# EAGLE schematic AM6548 (EAGLE 9.4.2), part 1 of 4

## Sheet 1 of 19: CPU General
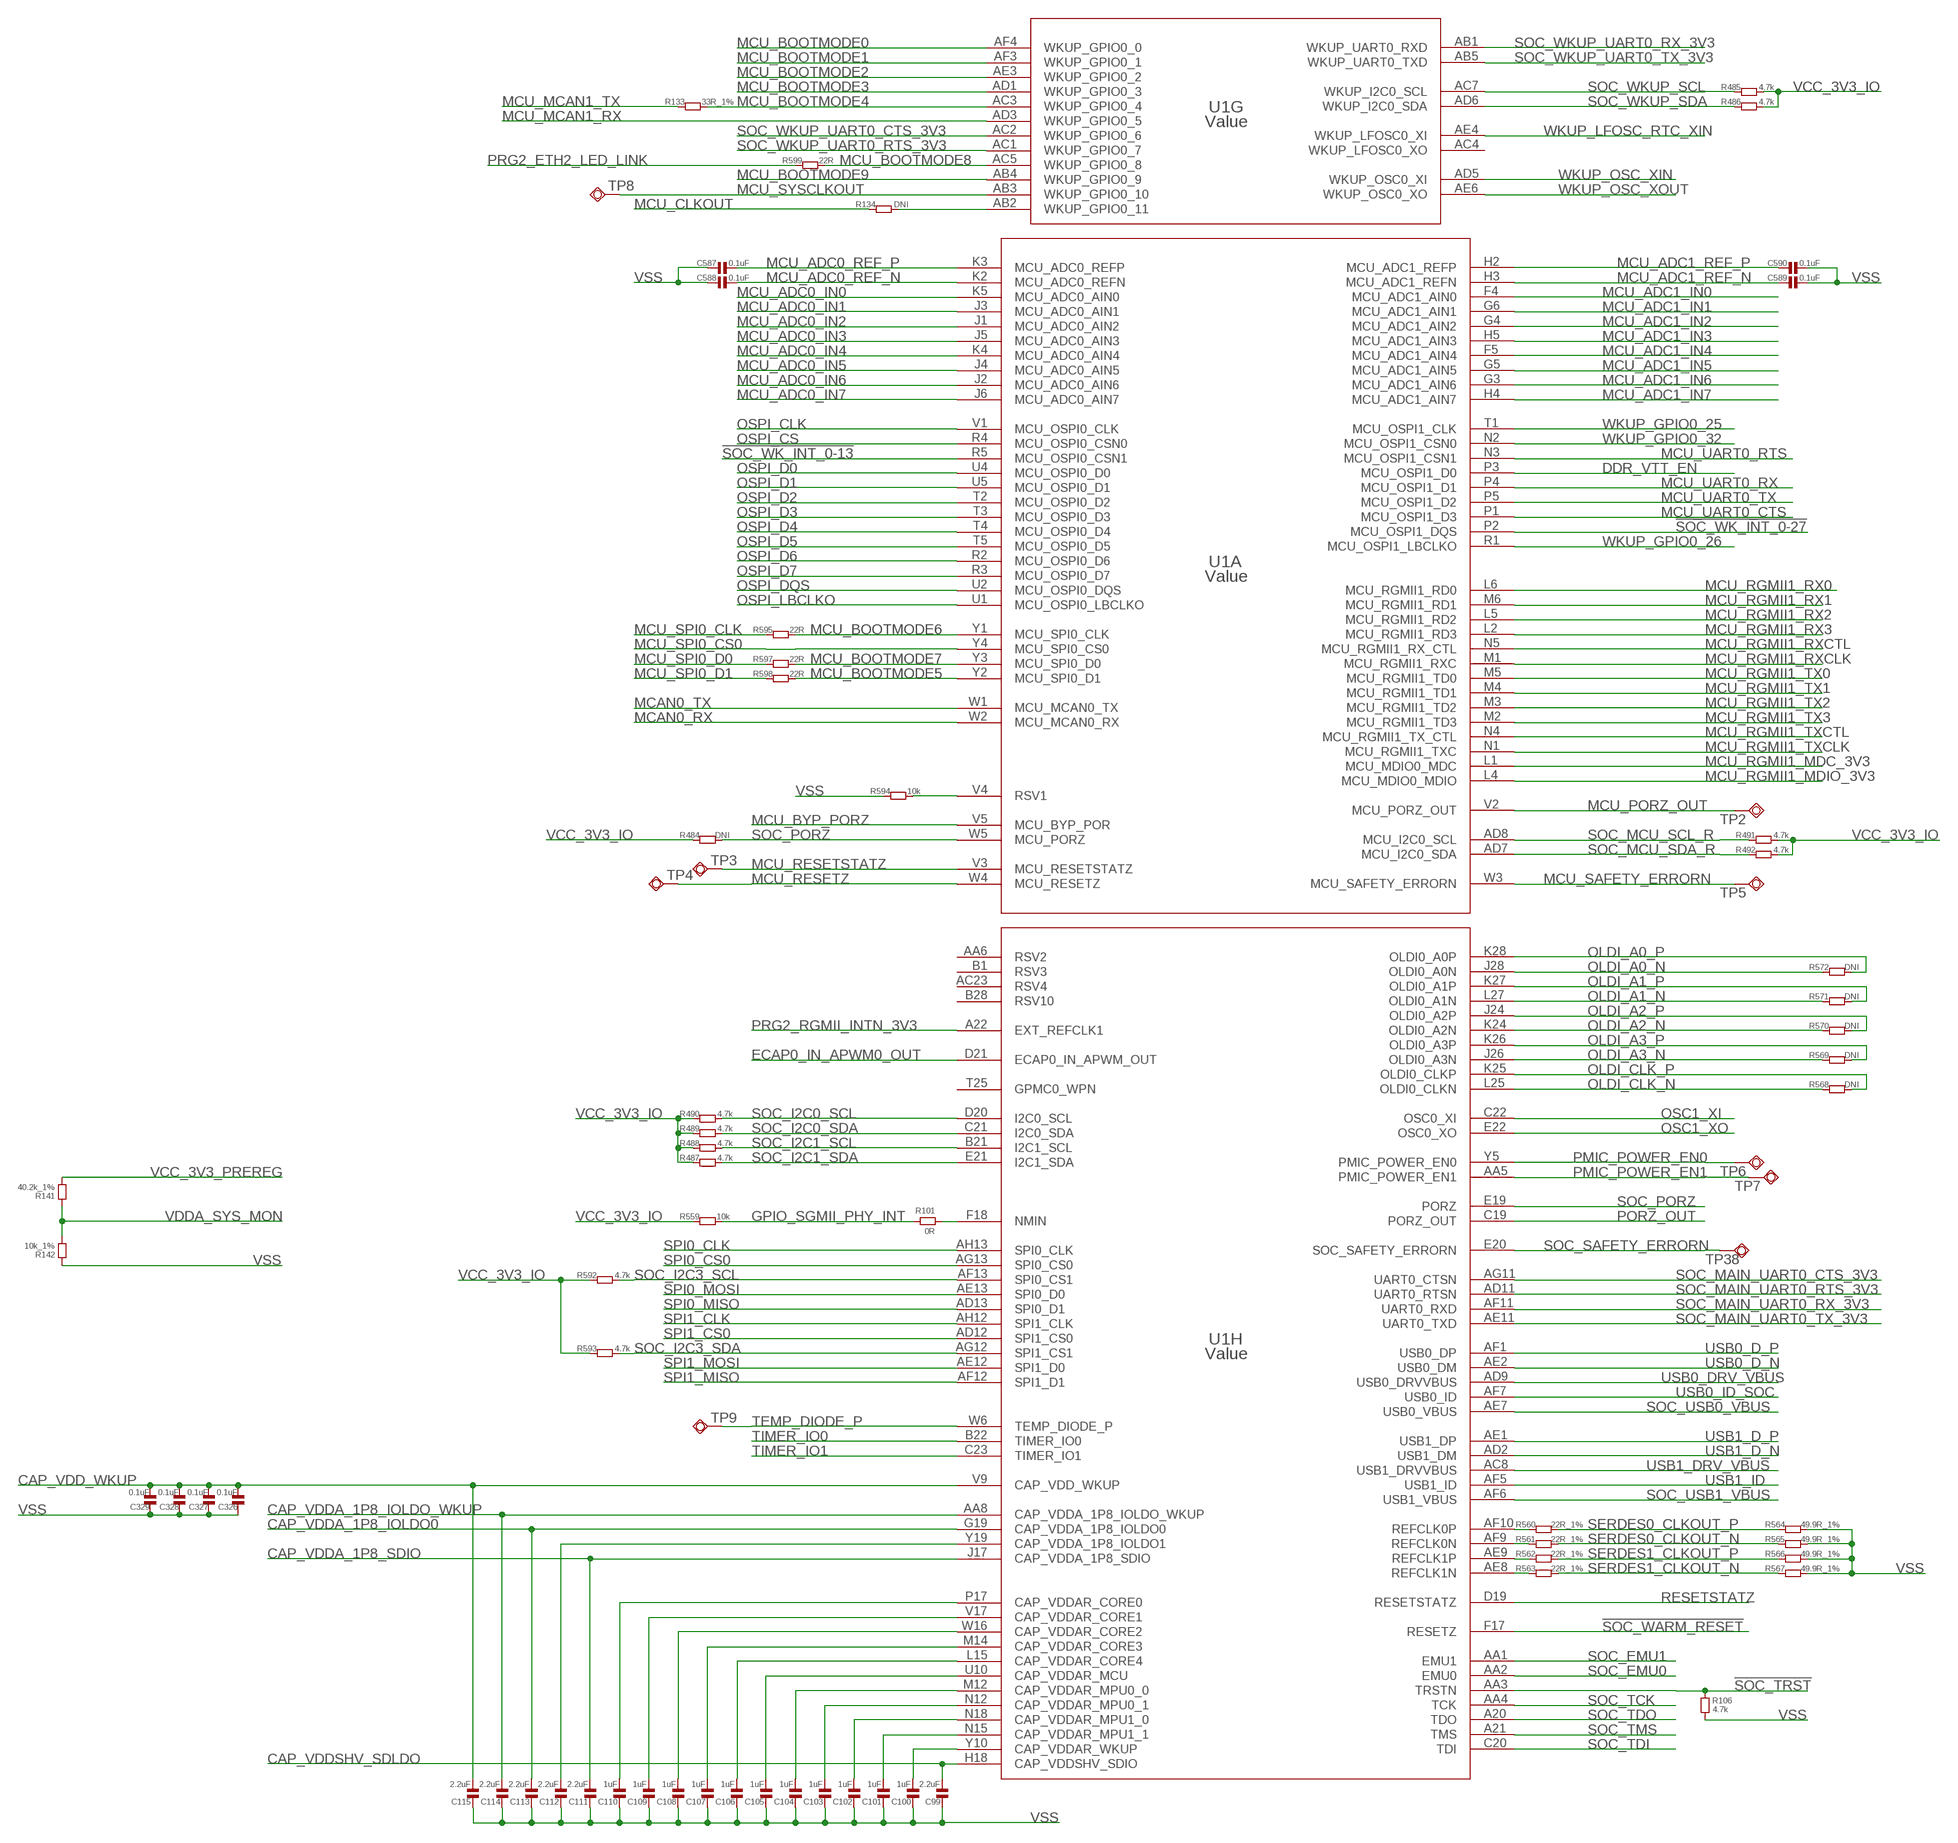
[diagram p0: schematic, sheet 1, part 1 of 2]
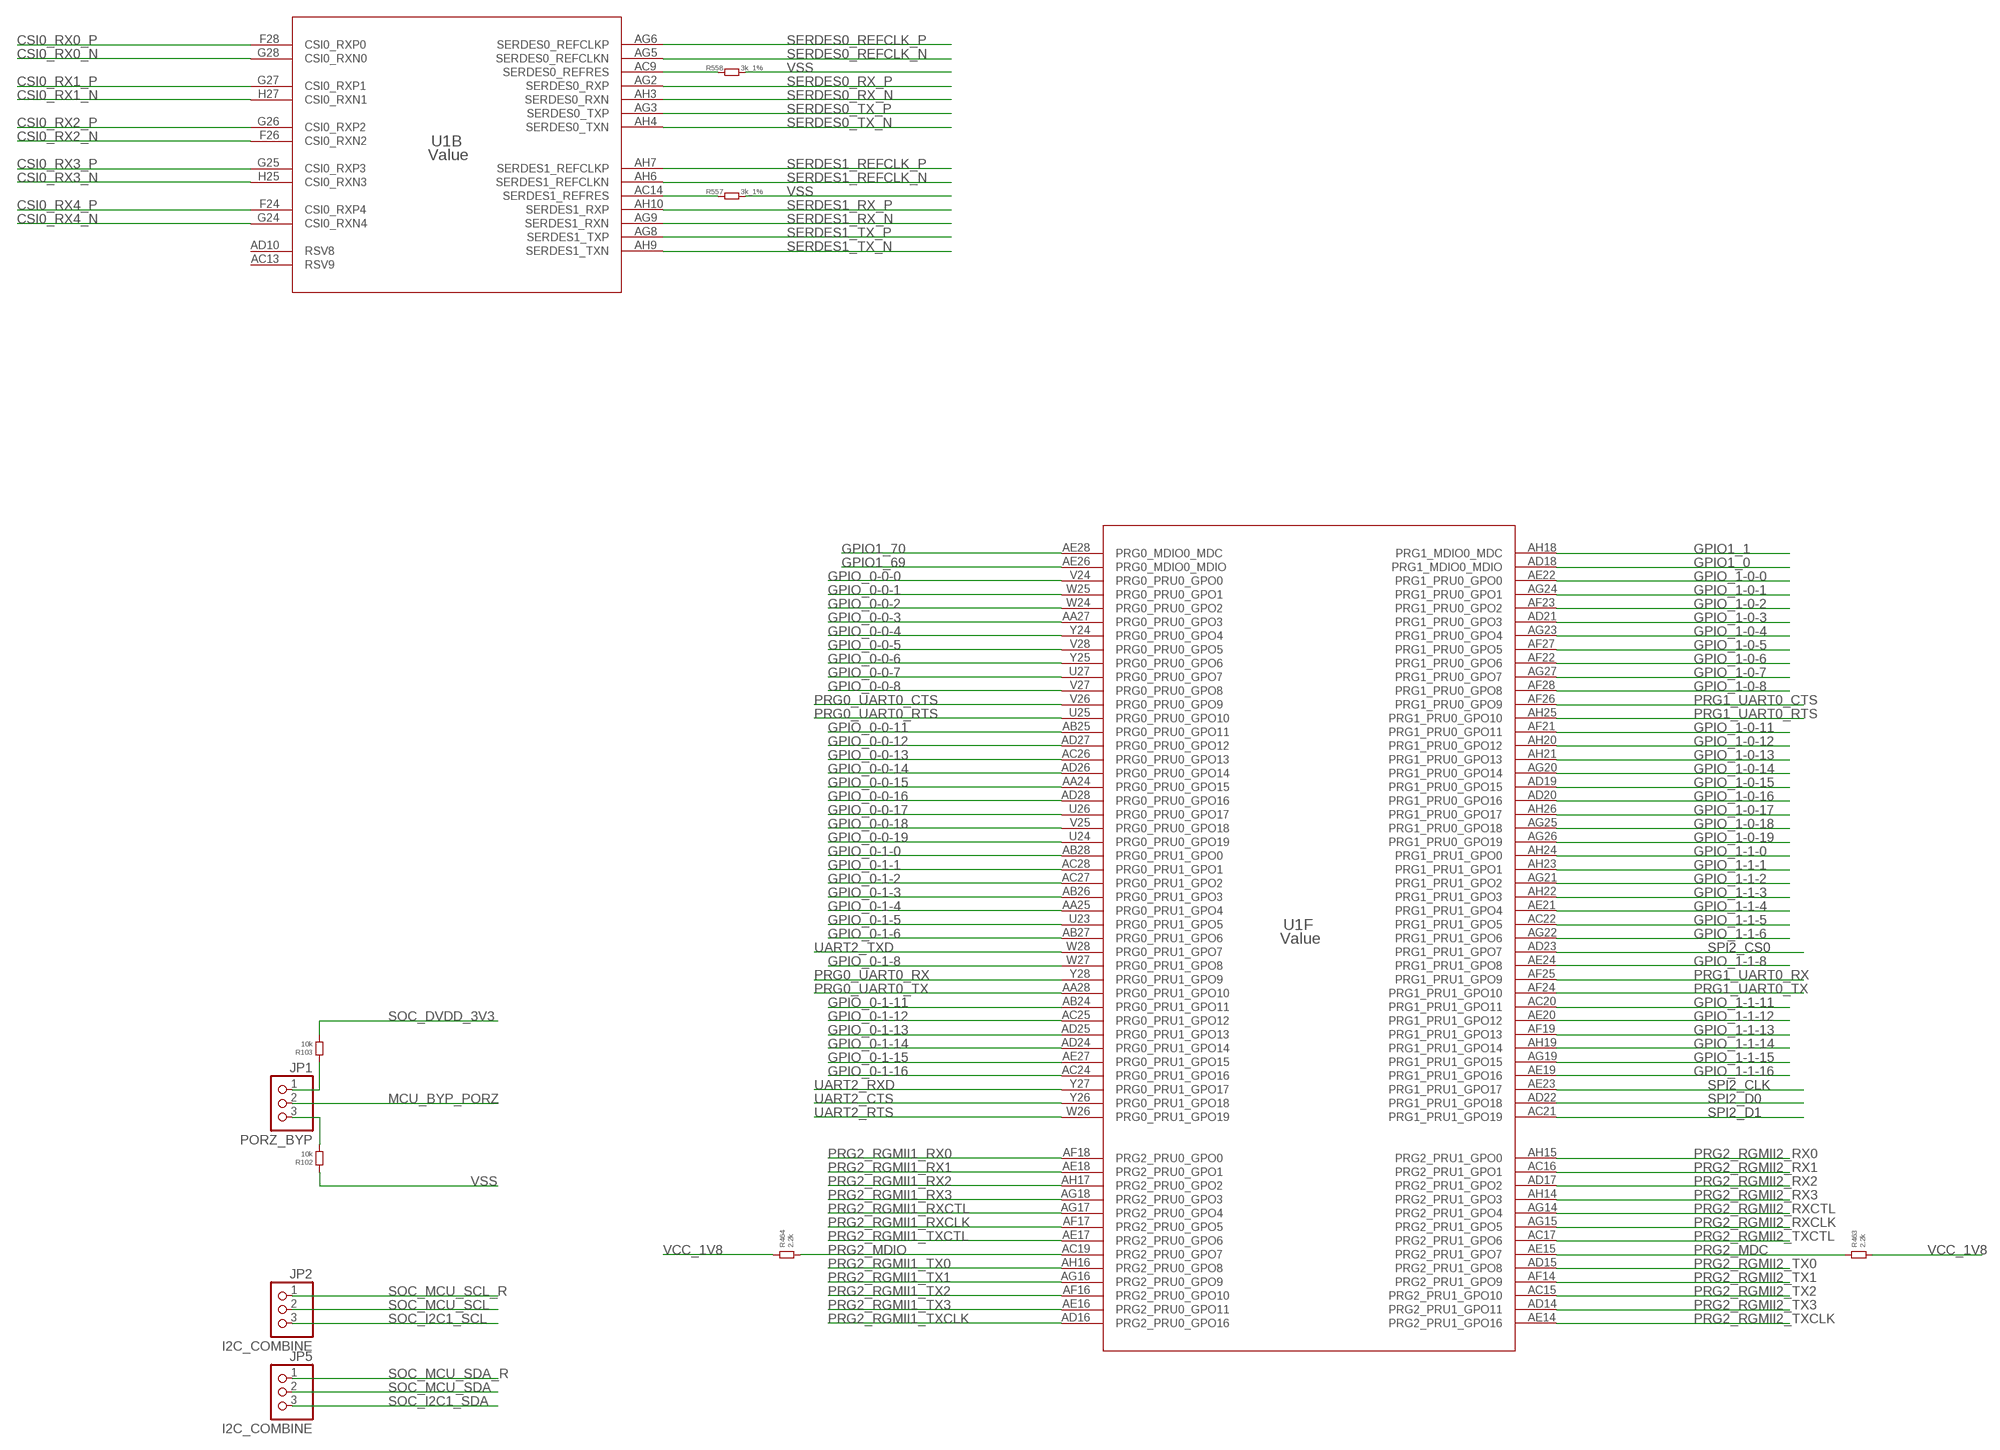
[diagram p1: schematic, sheet 1, part 2 of 2]

### Parts
C99  2.2uF  CAPACITOR.0201  [0201]
C100  1uF  CAPACITOR.0201  [0201]
C101  1uF  CAPACITOR.0201  [0201]
C102  1uF  CAPACITOR.0201  [0201]
C103  1uF  CAPACITOR.0201  [0201]
C104  1uF  CAPACITOR.0201  [0201]
C105  1uF  CAPACITOR.0201  [0201]
C106  1uF  CAPACITOR.0201  [0201]
C107  1uF  CAPACITOR.0201  [0201]
C108  1uF  CAPACITOR.0201  [0201]
C109  1uF  CAPACITOR.0201  [0201]
C110  1uF  CAPACITOR.0201  [0201]
C111  2.2uF  CAPACITOR.0201  [0201]
C112  2.2uF  CAPACITOR.0201  [0201]
C113  2.2uF  CAPACITOR.0201  [0201]
C114  2.2uF  CAPACITOR.0201  [0201]
C115  2.2uF  CAPACITOR.0201  [0201]
C326  0.1uF  CAPACITOR.0201  [0201]
C327  0.1uF  CAPACITOR.0201  [0201]
C328  0.1uF  CAPACITOR.0201  [0201]
C329  0.1uF  CAPACITOR.0201  [0201]
C587  0.1uF  CAPACITOR.0402  [0402]
C588  0.1uF  CAPACITOR.0402  [0402]
C589  0.1uF  CAPACITOR.0402  [0402]
C590  0.1uF  CAPACITOR.0402  [0402]
JP1  PORZ_BYP  PINHD-1X3  [1X03]
JP2  I2C_COMBINE  PINHD-1X3  [1X03]
JP5  I2C_COMBINE  PINHD-1X3  [1X03]
R101  0R  RESISTOR.0603  [0603]
R102  10k  RESISTOR.0603  [0603]
R103  10k  RESISTOR.0603  [0603]
R106  4.7k  RESISTOR.0402  [0402]
R133  33R_1%  RESISTOR.0402  [0402]
R134  DNI  RESISTOR.0402  [0402]
R141  40.2k_1%  RESISTOR.0603  [0603]
R142  10k_1%  RESISTOR.0603  [0603]
R463  2.2k  RESISTOR.0402  [0402]
R464  2.2k  RESISTOR.0402  [0402]
R484  DNI  RESISTOR.0603  [0603]
R485  4.7k  RESISTOR.0402  [0402]
R486  4.7k  RESISTOR.0402  [0402]
R487  4.7k  RESISTOR.0402  [0402]
R488  4.7k  RESISTOR.0402  [0402]
R489  4.7k  RESISTOR.0603  [0603]
R490  4.7k  RESISTOR.0603  [0603]
R491  4.7k  RESISTOR.0603  [0603]
R492  4.7k  RESISTOR.0603  [0603]
R557  3k_1%  RESISTOR.0402  [0402]
R558  3k_1%  RESISTOR.0402  [0402]
R559  10k  RESISTOR.0603  [0603]
R560  22R_1%  RESISTOR.0402  [0402]
R561  22R_1%  RESISTOR.0402  [0402]
R562  22R_1%  RESISTOR.0402  [0402]
R563  22R_1%  RESISTOR.0402  [0402]
R564  49.9R_1%  RESISTOR.0402  [0402]
R565  49.9R_1%  RESISTOR.0402  [0402]
R566  49.9R_1%  RESISTOR.0402  [0402]
R567  49.9R_1%  RESISTOR.0402  [0402]
R568  DNI  RESISTOR.0402  [0402]
R569  DNI  RESISTOR.0402  [0402]
R570  DNI  RESISTOR.0402  [0402]
R571  DNI  RESISTOR.0402  [0402]
R572  DNI  RESISTOR.0402  [0402]
R592  4.7k  RESISTOR.0603  [0603]
R593  4.7k  RESISTOR.0603  [0603]
R594  10k  RESISTOR.0603  [0603]
R595  22R  RESISTOR.0402  [0402]
R597  22R  RESISTOR.0402  [0402]
R598  22R  RESISTOR.0402  [0402]
R599  22R  RESISTOR.0603  [0603]
TP2  TESTPAD_TPSQB1,27  [TESTPAD_B1,27]
TP3  TESTPAD_TPSQB1,27  [TESTPAD_B1,27]
TP4  TESTPAD_TPSQB1,27  [TESTPAD_B1,27]
TP5  TESTPAD_TPSQB1,27  [TESTPAD_B1,27]
TP6  TESTPAD_TPSQB1,27  [TESTPAD_B1,27]
TP7  TESTPAD_TPSQB1,27  [TESTPAD_B1,27]
TP8  TESTPAD_TPSQB1,27  [TESTPAD_B1,27]
TP9  TESTPAD_TPSQB1,27  [TESTPAD_B1,27]
TP38  TESTPAD_TPSQB1,27  [TESTPAD_B1,27]
U1  Value  AM6548ACDXEAF  [ACD0784A]

### Nets
!SOC_TRST: R106.1 U1.AA3(H:TRSTN) ; also sheet 7
!SOC_WARM_RESET: U1.F17(H:RESETZ) ; also sheet 8
!SOC_WK_INT_0-13: U1.R5(A:MCU_OSPI0_CSN1) ; also sheet 8
!SOC_WK_INT_0-27: U1.P2(A:MCU_OSPI1_DQS) ; also sheet 8
CAP_VDD_WKUP: C115.2 C326.2 C327.2 C328.2 C329.2 U1.V9(H:CAP_VDD_WKUP) ; also sheet 2
CAP_VDDA_1P8_IOLDO0: C113.2 U1.G19(H:CAP_VDDA_1P8_IOLDO0) ; also sheet 2
CAP_VDDA_1P8_IOLDO_WKUP: C114.2 U1.AA8(H:CAP_VDDA_1P8_IOLDO_WKUP) ; also sheet 2
CAP_VDDA_1P8_SDIO: C111.2 U1.J17(H:CAP_VDDA_1P8_SDIO) ; also sheet 2
CAP_VDDSHV_SDLDO: C99.2 U1.H18(H:CAP_VDDSHV_SDIO) ; also sheet 2
CSI0_RX0_N: U1.G28(B:CSI0_RXN0) ; also sheet 19
CSI0_RX0_P: U1.F28(B:CSI0_RXP0) ; also sheet 19
CSI0_RX1_N: U1.H27(B:CSI0_RXN1) ; also sheet 19
CSI0_RX1_P: U1.G27(B:CSI0_RXP1) ; also sheet 19
CSI0_RX2_N: U1.F26(B:CSI0_RXN2) ; also sheet 19
CSI0_RX2_P: U1.G26(B:CSI0_RXP2) ; also sheet 19
CSI0_RX3_N: U1.H25(B:CSI0_RXN3) ; also sheet 19
CSI0_RX3_P: U1.G25(B:CSI0_RXP3) ; also sheet 19
CSI0_RX4_N: U1.G24(B:CSI0_RXN4) ; also sheet 19
CSI0_RX4_P: U1.F24(B:CSI0_RXP4) ; also sheet 19
DDR_VTT_EN: U1.P3(A:MCU_OSPI1_D0) ; also sheet 15
ECAP0_IN_APWM0_OUT: U1.D21(H:ECAP0_IN_APWM_OUT) ; also sheet 16
GPIO1_0: U1.AD18(F:PRG1_MDIO0_MDIO) ; also sheet 8,19
GPIO1_1: U1.AH18(F:PRG1_MDIO0_MDC) ; also sheet 8,19
GPIO1_69: U1.AE26(F:PRG0_MDIO0_MDIO) ; also sheet 19
GPIO1_70: U1.AE28(F:PRG0_MDIO0_MDC) ; also sheet 19
GPIO_0-0-0 [5mil]: U1.V24(F:PRG0_PRU0_GPO0) ; also sheet 19
GPIO_0-0-1 [5mil]: U1.W25(F:PRG0_PRU0_GPO1) ; also sheet 19
GPIO_0-0-2 [5mil]: U1.W24(F:PRG0_PRU0_GPO2) ; also sheet 19
GPIO_0-0-3 [5mil]: U1.AA27(F:PRG0_PRU0_GPO3) ; also sheet 19
GPIO_0-0-4 [5mil]: U1.Y24(F:PRG0_PRU0_GPO4) ; also sheet 19
GPIO_0-0-5 [5mil]: U1.V28(F:PRG0_PRU0_GPO5) ; also sheet 19
GPIO_0-0-6 [5mil]: U1.Y25(F:PRG0_PRU0_GPO6) ; also sheet 19
GPIO_0-0-7 [5mil]: U1.U27(F:PRG0_PRU0_GPO7) ; also sheet 19
GPIO_0-0-8 [5mil]: U1.V27(F:PRG0_PRU0_GPO8) ; also sheet 19
GPIO_0-0-11 [5mil]: U1.AB25(F:PRG0_PRU0_GPO11) ; also sheet 19
GPIO_0-0-12 [5mil]: U1.AD27(F:PRG0_PRU0_GPO12) ; also sheet 19
GPIO_0-0-13 [5mil]: U1.AC26(F:PRG0_PRU0_GPO13) ; also sheet 19
GPIO_0-0-14 [5mil]: U1.AD26(F:PRG0_PRU0_GPO14) ; also sheet 19
GPIO_0-0-15 [5mil]: U1.AA24(F:PRG0_PRU0_GPO15) ; also sheet 19
GPIO_0-0-16 [5mil]: U1.AD28(F:PRG0_PRU0_GPO16) ; also sheet 19
GPIO_0-0-17 [5mil]: U1.U26(F:PRG0_PRU0_GPO17) ; also sheet 19
GPIO_0-0-18 [5mil]: U1.V25(F:PRG0_PRU0_GPO18) ; also sheet 19
GPIO_0-0-19 [5mil]: U1.U24(F:PRG0_PRU0_GPO19) ; also sheet 19
GPIO_0-1-0 [5mil]: U1.AB28(F:PRG0_PRU1_GPO0) ; also sheet 19
GPIO_0-1-1 [5mil]: U1.AC28(F:PRG0_PRU1_GPO1) ; also sheet 19
GPIO_0-1-2 [5mil]: U1.AC27(F:PRG0_PRU1_GPO2) ; also sheet 19
GPIO_0-1-3 [5mil]: U1.AB26(F:PRG0_PRU1_GPO3) ; also sheet 19
GPIO_0-1-4 [5mil]: U1.AA25(F:PRG0_PRU1_GPO4) ; also sheet 19
GPIO_0-1-5 [5mil]: U1.U23(F:PRG0_PRU1_GPO5) ; also sheet 19
GPIO_0-1-6 [5mil]: U1.AB27(F:PRG0_PRU1_GPO6) ; also sheet 19
GPIO_0-1-8 [5mil]: U1.W27(F:PRG0_PRU1_GPO8) ; also sheet 19
GPIO_0-1-11 [5mil]: U1.AB24(F:PRG0_PRU1_GPO11) ; also sheet 19
GPIO_0-1-12 [5mil]: U1.AC25(F:PRG0_PRU1_GPO12) ; also sheet 19
GPIO_0-1-13 [5mil]: U1.AD25(F:PRG0_PRU1_GPO13) ; also sheet 19
GPIO_0-1-14 [5mil]: U1.AD24(F:PRG0_PRU1_GPO14) ; also sheet 19
GPIO_0-1-15 [5mil]: U1.AE27(F:PRG0_PRU1_GPO15) ; also sheet 19
GPIO_0-1-16 [5mil]: U1.AC24(F:PRG0_PRU1_GPO16) ; also sheet 19
GPIO_1-0-0 [5mil]: U1.AE22(F:PRG1_PRU0_GPO0) ; also sheet 19
GPIO_1-0-1 [5mil]: U1.AG24(F:PRG1_PRU0_GPO1) ; also sheet 19
GPIO_1-0-2 [5mil]: U1.AF23(F:PRG1_PRU0_GPO2) ; also sheet 19
GPIO_1-0-3 [5mil]: U1.AD21(F:PRG1_PRU0_GPO3) ; also sheet 19
GPIO_1-0-4 [5mil]: U1.AG23(F:PRG1_PRU0_GPO4) ; also sheet 19
GPIO_1-0-5 [5mil]: U1.AF27(F:PRG1_PRU0_GPO5) ; also sheet 19
GPIO_1-0-6 [5mil]: U1.AF22(F:PRG1_PRU0_GPO6) ; also sheet 19
GPIO_1-0-7 [5mil]: U1.AG27(F:PRG1_PRU0_GPO7) ; also sheet 19
GPIO_1-0-8 [5mil]: U1.AF28(F:PRG1_PRU0_GPO8) ; also sheet 19
GPIO_1-0-11 [5mil]: U1.AF21(F:PRG1_PRU0_GPO11) ; also sheet 19
GPIO_1-0-12 [5mil]: U1.AH20(F:PRG1_PRU0_GPO12) ; also sheet 19
GPIO_1-0-13 [5mil]: U1.AH21(F:PRG1_PRU0_GPO13) ; also sheet 19
GPIO_1-0-14 [5mil]: U1.AG20(F:PRG1_PRU0_GPO14) ; also sheet 19
GPIO_1-0-15 [5mil]: U1.AD19(F:PRG1_PRU0_GPO15) ; also sheet 19
GPIO_1-0-16 [5mil]: U1.AD20(F:PRG1_PRU0_GPO16) ; also sheet 19
GPIO_1-0-17 [5mil]: U1.AH26(F:PRG1_PRU0_GPO17) ; also sheet 19
GPIO_1-0-18 [5mil]: U1.AG25(F:PRG1_PRU0_GPO18) ; also sheet 19
GPIO_1-0-19 [5mil]: U1.AG26(F:PRG1_PRU0_GPO19) ; also sheet 19
GPIO_1-1-0 [5mil]: U1.AH24(F:PRG1_PRU1_GPO0) ; also sheet 19
GPIO_1-1-1 [5mil]: U1.AH23(F:PRG1_PRU1_GPO1) ; also sheet 19
GPIO_1-1-2 [5mil]: U1.AG21(F:PRG1_PRU1_GPO2) ; also sheet 19
GPIO_1-1-3 [5mil]: U1.AH22(F:PRG1_PRU1_GPO3) ; also sheet 19
GPIO_1-1-4 [5mil]: U1.AE21(F:PRG1_PRU1_GPO4) ; also sheet 19
GPIO_1-1-5 [5mil]: U1.AC22(F:PRG1_PRU1_GPO5) ; also sheet 19
GPIO_1-1-6 [5mil]: U1.AG22(F:PRG1_PRU1_GPO6) ; also sheet 19
GPIO_1-1-8 [5mil]: U1.AE24(F:PRG1_PRU1_GPO8) ; also sheet 19
GPIO_1-1-11 [5mil]: U1.AC20(F:PRG1_PRU1_GPO11) ; also sheet 19
GPIO_1-1-12 [5mil]: U1.AE20(F:PRG1_PRU1_GPO12) ; also sheet 19
GPIO_1-1-13 [5mil]: U1.AF19(F:PRG1_PRU1_GPO13) ; also sheet 19
GPIO_1-1-14 [5mil]: U1.AH19(F:PRG1_PRU1_GPO14) ; also sheet 19
GPIO_1-1-15 [5mil]: U1.AG19(F:PRG1_PRU1_GPO15) ; also sheet 19
GPIO_1-1-16 [5mil]: U1.AE19(F:PRG1_PRU1_GPO16) ; also sheet 19
GPIO_SGMII_PHY_INT: R101.1 R559.2 ; also sheet 19
MCAN0_RX: U1.W2(A:MCU_MCAN0_RX) ; also sheet 19
MCAN0_TX: U1.W1(A:MCU_MCAN0_TX) ; also sheet 19
MCU_ADC0_IN0: U1.K5(A:MCU_ADC0_AIN0) ; also sheet 19
MCU_ADC0_IN1: U1.J3(A:MCU_ADC0_AIN1) ; also sheet 19
MCU_ADC0_IN2: U1.J1(A:MCU_ADC0_AIN2) ; also sheet 19
MCU_ADC0_IN3: U1.J5(A:MCU_ADC0_AIN3) ; also sheet 19
MCU_ADC0_IN4: U1.K4(A:MCU_ADC0_AIN4) ; also sheet 19
MCU_ADC0_IN5: U1.J4(A:MCU_ADC0_AIN5) ; also sheet 19
MCU_ADC0_IN6: U1.J2(A:MCU_ADC0_AIN6) ; also sheet 19
MCU_ADC0_IN7: U1.J6(A:MCU_ADC0_AIN7) ; also sheet 19
MCU_ADC0_REF_N: C588.2 U1.K2(A:MCU_ADC0_REFN) ; also sheet 19
MCU_ADC0_REF_P: C587.2 U1.K3(A:MCU_ADC0_REFP) ; also sheet 19
MCU_ADC1_IN0: U1.F4(A:MCU_ADC1_AIN0)
MCU_ADC1_IN1: U1.G6(A:MCU_ADC1_AIN1)
MCU_ADC1_IN2: U1.G4(A:MCU_ADC1_AIN2)
MCU_ADC1_IN3: U1.H5(A:MCU_ADC1_AIN3)
MCU_ADC1_IN4: U1.F5(A:MCU_ADC1_AIN4)
MCU_ADC1_IN5: U1.G5(A:MCU_ADC1_AIN5)
MCU_ADC1_IN6: U1.G3(A:MCU_ADC1_AIN6)
MCU_ADC1_IN7: U1.H4(A:MCU_ADC1_AIN7)
MCU_ADC1_REF_N: C589.1 U1.H3(A:MCU_ADC1_REFN)
MCU_ADC1_REF_P: C590.1 U1.H2(A:MCU_ADC1_REFP)
MCU_BOOTMODE0: U1.AF4(G:WKUP_GPIO0_0) ; also sheet 6,11
MCU_BOOTMODE1: U1.AF3(G:WKUP_GPIO0_1) ; also sheet 6,11
MCU_BOOTMODE2: U1.AE3(G:WKUP_GPIO0_2) ; also sheet 11
MCU_BOOTMODE3: U1.AD1(G:WKUP_GPIO0_3) ; also sheet 11
MCU_BOOTMODE4: R133.2 U1.AC3(G:WKUP_GPIO0_4) ; also sheet 11
MCU_BOOTMODE5: R598.2 U1.Y2(A:MCU_SPI0_D1) ; also sheet 11
MCU_BOOTMODE6: R595.2 U1.Y1(A:MCU_SPI0_CLK) ; also sheet 11
MCU_BOOTMODE7: R597.2 U1.Y3(A:MCU_SPI0_D0) ; also sheet 11
MCU_BOOTMODE8: R599.2 U1.AC5(G:WKUP_GPIO0_8) ; also sheet 11
MCU_BOOTMODE9: U1.AB4(G:WKUP_GPIO0_9) ; also sheet 11
MCU_BYP_PORZ: JP1.2 U1.V5(A:MCU_BYP_POR)
MCU_CLKOUT: R134.1 ; also sheet 14
MCU_MCAN1_RX: U1.AD3(G:WKUP_GPIO0_5) ; also sheet 19
MCU_MCAN1_TX: R133.1 ; also sheet 19
MCU_PORZ_OUT: TP2.TP U1.V2(A:MCU_PORZ_OUT)
MCU_RESETSTATZ: TP3.TP U1.V3(A:MCU_RESETSTATZ)
MCU_RESETZ: TP4.TP U1.W4(A:MCU_RESETZ)
MCU_RGMII1_MDC_3V3: U1.L1(A:MCU_MDIO0_MDC) ; also sheet 6
MCU_RGMII1_MDIO_3V3: U1.L4(A:MCU_MDIO0_MDIO) ; also sheet 6
MCU_RGMII1_RX0: U1.L6(A:MCU_RGMII1_RD0) ; also sheet 6
MCU_RGMII1_RX1: U1.M6(A:MCU_RGMII1_RD1) ; also sheet 6
MCU_RGMII1_RX2: U1.L5(A:MCU_RGMII1_RD2) ; also sheet 6
MCU_RGMII1_RX3: U1.L2(A:MCU_RGMII1_RD3) ; also sheet 6
MCU_RGMII1_RXCLK: U1.M1(A:MCU_RGMII1_RXC) ; also sheet 6
MCU_RGMII1_RXCTL: U1.N5(A:MCU_RGMII1_RX_CTL) ; also sheet 6
MCU_RGMII1_TX0: U1.M5(A:MCU_RGMII1_TD0) ; also sheet 6
MCU_RGMII1_TX1: U1.M4(A:MCU_RGMII1_TD1) ; also sheet 6
MCU_RGMII1_TX2: U1.M3(A:MCU_RGMII1_TD2) ; also sheet 6
MCU_RGMII1_TX3: U1.M2(A:MCU_RGMII1_TD3) ; also sheet 6
MCU_RGMII1_TXCLK: U1.N1(A:MCU_RGMII1_TXC) ; also sheet 6
MCU_RGMII1_TXCTL: U1.N4(A:MCU_RGMII1_TX_CTL) ; also sheet 6
MCU_SAFETY_ERRORN: TP5.TP U1.W3(A:MCU_SAFETY_ERRORN)
MCU_SPI0_CLK: R595.1 ; also sheet 19
MCU_SPI0_CS0: U1.Y4(A:MCU_SPI0_CS0)
MCU_SPI0_D0: R597.1 ; also sheet 19
MCU_SPI0_D1: R598.1 ; also sheet 19
MCU_SYSCLKOUT: TP8.TP U1.AB3(G:WKUP_GPIO0_10)
MCU_UART0_CTS: U1.P1(A:MCU_OSPI1_D3) ; also sheet 19
MCU_UART0_RTS: U1.N3(A:MCU_OSPI1_CSN1) ; also sheet 19
MCU_UART0_RX: U1.P4(A:MCU_OSPI1_D1) ; also sheet 19
MCU_UART0_TX: U1.P5(A:MCU_OSPI1_D2) ; also sheet 19
N$81: R134.2 U1.AB2(G:WKUP_GPIO0_11)
N$103: R101.2 U1.F18(H:NMIN)
N$104: JP1.1 R103.1
N$105: JP1.3 R102.2
N$124: C100.2 U1.Y10(H:CAP_VDDAR_WKUP)
N$125: C101.2 U1.N15(H:CAP_VDDAR_MPU1_1)
N$126: C102.2 U1.N18(H:CAP_VDDAR_MPU1_0)
N$127: C103.2 U1.N12(H:CAP_VDDAR_MPU0_1)
N$128: C104.2 U1.M12(H:CAP_VDDAR_MPU0_0)
N$129: C105.2 U1.U10(H:CAP_VDDAR_MCU)
N$130: C106.2 U1.L15(H:CAP_VDDAR_CORE4)
N$131: C107.2 U1.M14(H:CAP_VDDAR_CORE3)
N$132: C108.2 U1.W16(H:CAP_VDDAR_CORE2)
N$133: C109.2 U1.V17(H:CAP_VDDAR_CORE1)
N$134: C110.2 U1.P17(H:CAP_VDDAR_CORE0)
N$136: C112.2 U1.Y19(H:CAP_VDDA_1P8_IOLDO1)
N$194: R594.2 U1.V4(A:RSV1)
N$397: R560.1 U1.AF10(H:REFCLK0P)
N$398: R561.1 U1.AF9(H:REFCLK0N)
N$399: R562.1 U1.AE9(H:REFCLK1P)
N$400: R563.1 U1.AE8(H:REFCLK1N)
N$409: R557.1 U1.AC14(B:SERDES1_REFRES)
N$410: R558.1 U1.AC9(B:SERDES0_REFRES)
OLDI_A0_N: R572.1 U1.J28(H:OLDI0_A0N) ; also sheet 16
OLDI_A0_P: R572.2 U1.K28(H:OLDI0_A0P) ; also sheet 16
OLDI_A1_N: R571.1 U1.L27(H:OLDI0_A1N) ; also sheet 16
OLDI_A1_P: R571.2 U1.K27(H:OLDI0_A1P) ; also sheet 16
OLDI_A2_N: R570.1 U1.K24(H:OLDI0_A2N) ; also sheet 16
OLDI_A2_P: R570.2 U1.J24(H:OLDI0_A2P) ; also sheet 16
OLDI_A3_N: R569.1 U1.J26(H:OLDI0_A3N) ; also sheet 16
OLDI_A3_P: R569.2 U1.K26(H:OLDI0_A3P) ; also sheet 16
OLDI_CLK_N: R568.1 U1.L25(H:OLDI0_CLKN) ; also sheet 16
OLDI_CLK_P: R568.2 U1.K25(H:OLDI0_CLKP) ; also sheet 16
OSC1_XI: U1.C22(H:OSC0_XI) ; also sheet 14
OSC1_XO: U1.E22(H:OSC0_XO) ; also sheet 14
OSPI_CLK: U1.V1(A:MCU_OSPI0_CLK) ; also sheet 18
OSPI_CS: U1.R4(A:MCU_OSPI0_CSN0) ; also sheet 18
OSPI_D0: U1.U4(A:MCU_OSPI0_D0) ; also sheet 18
OSPI_D1: U1.U5(A:MCU_OSPI0_D1) ; also sheet 18
OSPI_D2: U1.T2(A:MCU_OSPI0_D2) ; also sheet 18
OSPI_D3: U1.T3(A:MCU_OSPI0_D3) ; also sheet 18
OSPI_D4: U1.T4(A:MCU_OSPI0_D4) ; also sheet 18
OSPI_D5: U1.T5(A:MCU_OSPI0_D5) ; also sheet 18
OSPI_D6: U1.R2(A:MCU_OSPI0_D6) ; also sheet 18
OSPI_D7: U1.R3(A:MCU_OSPI0_D7) ; also sheet 18
OSPI_DQS: U1.U2(A:MCU_OSPI0_DQS) ; also sheet 18
OSPI_LBCLKO: U1.U1(A:MCU_OSPI0_LBCLKO)
PMIC_POWER_EN0: TP6.TP U1.Y5(H:PMIC_POWER_EN0)
PMIC_POWER_EN1: TP7.TP U1.AA5(H:PMIC_POWER_EN1)
PORZ_OUT: U1.C19(H:PORZ_OUT) ; also sheet 6,11,13,16,17,18,19
PRG0_UART0_CTS: U1.V26(F:PRG0_PRU0_GPO9) ; also sheet 19
PRG0_UART0_RTS: U1.U25(F:PRG0_PRU0_GPO10) ; also sheet 19
PRG0_UART0_RX: U1.Y28(F:PRG0_PRU1_GPO9) ; also sheet 19
PRG0_UART0_TX: U1.AA28(F:PRG0_PRU1_GPO10) ; also sheet 19
PRG1_UART0_CTS: U1.AF26(F:PRG1_PRU0_GPO9) ; also sheet 19
PRG1_UART0_RTS: U1.AH25(F:PRG1_PRU0_GPO10) ; also sheet 19
PRG1_UART0_RX: U1.AF25(F:PRG1_PRU1_GPO9) ; also sheet 19
PRG1_UART0_TX: U1.AF24(F:PRG1_PRU1_GPO10) ; also sheet 19
PRG2_ETH2_LED_LINK: R599.1
PRG2_MDC: R463.1 U1.AE15(F:PRG2_PRU1_GPO7) ; also sheet 6
PRG2_MDIO: R464.2 U1.AC19(F:PRG2_PRU0_GPO7) ; also sheet 6
PRG2_RGMII1_RX0: U1.AF18(F:PRG2_PRU0_GPO0) ; also sheet 6
PRG2_RGMII1_RX1: U1.AE18(F:PRG2_PRU0_GPO1) ; also sheet 6
PRG2_RGMII1_RX2: U1.AH17(F:PRG2_PRU0_GPO2) ; also sheet 6
PRG2_RGMII1_RX3: U1.AG18(F:PRG2_PRU0_GPO3) ; also sheet 6
PRG2_RGMII1_RXCLK: U1.AF17(F:PRG2_PRU0_GPO5) ; also sheet 6
PRG2_RGMII1_RXCTL: U1.AG17(F:PRG2_PRU0_GPO4) ; also sheet 6
PRG2_RGMII1_TX0: U1.AH16(F:PRG2_PRU0_GPO8) ; also sheet 6
PRG2_RGMII1_TX1: U1.AG16(F:PRG2_PRU0_GPO9) ; also sheet 6
PRG2_RGMII1_TX2: U1.AF16(F:PRG2_PRU0_GPO10) ; also sheet 6
PRG2_RGMII1_TX3: U1.AE16(F:PRG2_PRU0_GPO11) ; also sheet 6
PRG2_RGMII1_TXCLK: U1.AD16(F:PRG2_PRU0_GPO16) ; also sheet 6
PRG2_RGMII1_TXCTL: U1.AE17(F:PRG2_PRU0_GPO6) ; also sheet 6
PRG2_RGMII2_RX0: U1.AH15(F:PRG2_PRU1_GPO0) ; also sheet 6
PRG2_RGMII2_RX1: U1.AC16(F:PRG2_PRU1_GPO1) ; also sheet 6
PRG2_RGMII2_RX2: U1.AD17(F:PRG2_PRU1_GPO2) ; also sheet 6
PRG2_RGMII2_RX3: U1.AH14(F:PRG2_PRU1_GPO3) ; also sheet 6
PRG2_RGMII2_RXCLK: U1.AG15(F:PRG2_PRU1_GPO5) ; also sheet 6
PRG2_RGMII2_RXCTL: U1.AG14(F:PRG2_PRU1_GPO4) ; also sheet 6
PRG2_RGMII2_TX0: U1.AD15(F:PRG2_PRU1_GPO8) ; also sheet 6
PRG2_RGMII2_TX1: U1.AF14(F:PRG2_PRU1_GPO9) ; also sheet 6
PRG2_RGMII2_TX2: U1.AC15(F:PRG2_PRU1_GPO10) ; also sheet 6
PRG2_RGMII2_TX3: U1.AD14(F:PRG2_PRU1_GPO11) ; also sheet 6
PRG2_RGMII2_TXCLK: U1.AE14(F:PRG2_PRU1_GPO16) ; also sheet 6
PRG2_RGMII2_TXCTL: U1.AC17(F:PRG2_PRU1_GPO6) ; also sheet 6
PRG2_RGMII_INTN_3V3: U1.A22(H:EXT_REFCLK1)
RESETSTATZ: U1.D19(H:RESETSTATZ)
SERDES0_CLKOUT_N: R561.2 R565.1 ; also sheet 19
SERDES0_CLKOUT_P: R560.2 R564.1 ; also sheet 19
SERDES0_REFCLK_N: U1.AG5(B:SERDES0_REFCLKN) ; also sheet 19
SERDES0_REFCLK_P: U1.AG6(B:SERDES0_REFCLKP) ; also sheet 19
SERDES0_RX_N: U1.AH3(B:SERDES0_RXN) ; also sheet 19
SERDES0_RX_P: U1.AG2(B:SERDES0_RXP) ; also sheet 19
SERDES0_TX_N: U1.AH4(B:SERDES0_TXN) ; also sheet 19
SERDES0_TX_P: U1.AG3(B:SERDES0_TXP) ; also sheet 19
SERDES1_CLKOUT_N: R563.2 R567.1 ; also sheet 19
SERDES1_CLKOUT_P: R562.2 R566.1 ; also sheet 19
SERDES1_REFCLK_N: U1.AH6(B:SERDES1_REFCLKN) ; also sheet 19
SERDES1_REFCLK_P: U1.AH7(B:SERDES1_REFCLKP) ; also sheet 19
SERDES1_RX_N: U1.AG9(B:SERDES1_RXN) ; also sheet 19
SERDES1_RX_P: U1.AH10(B:SERDES1_RXP) ; also sheet 19
SERDES1_TX_N: U1.AH9(B:SERDES1_TXN) ; also sheet 19
SERDES1_TX_P: U1.AG8(B:SERDES1_TXP) ; also sheet 19
SOC_DVDD_3V3: R103.2 ; also sheet 2,10
SOC_EMU0: U1.AA2(H:EMU0) ; also sheet 7
SOC_EMU1: U1.AA1(H:EMU1) ; also sheet 7
SOC_I2C0_SCL: R490.2 U1.D20(H:I2C0_SCL) ; also sheet 14,19
SOC_I2C0_SDA: R489.2 U1.C21(H:I2C0_SDA) ; also sheet 14,19
SOC_I2C1_SCL: JP2.3 R488.2 U1.B21(H:I2C1_SCL) ; also sheet 16,19
SOC_I2C1_SDA: JP5.3 R487.2 U1.E21(H:I2C1_SDA) ; also sheet 16,19
SOC_I2C3_SCL: R592.2 U1.AF13(H:SPI0_CS1) ; also sheet 19
SOC_I2C3_SDA: R593.2 U1.AG12(H:SPI1_CS1) ; also sheet 19
SOC_MAIN_UART0_CTS_3V3: U1.AG11(H:UART0_CTSN)
SOC_MAIN_UART0_RTS_3V3: U1.AD11(H:UART0_RTSN)
SOC_MAIN_UART0_RX_3V3: U1.AF11(H:UART0_RXD)
SOC_MAIN_UART0_TX_3V3: U1.AE11(H:UART0_TXD)
SOC_MCU_SCL: JP2.2 ; also sheet 15,19
SOC_MCU_SCL_R: JP2.1 R491.1 U1.AD8(A:MCU_I2C0_SCL)
SOC_MCU_SDA: JP5.2 ; also sheet 15,19
SOC_MCU_SDA_R: JP5.1 R492.1 U1.AD7(A:MCU_I2C0_SDA)
SOC_PORZ: R484.2 U1.E19(H:PORZ) U1.W5(A:MCU_PORZ) ; also sheet 5
SOC_SAFETY_ERRORN: TP38.TP U1.E20(H:SOC_SAFETY_ERRORN)
SOC_TCK: U1.AA4(H:TCK) ; also sheet 7
SOC_TDI: U1.C20(H:TDI) ; also sheet 7
SOC_TDO: U1.A20(H:TDO) ; also sheet 7
SOC_TMS: U1.A21(H:TMS) ; also sheet 7
SOC_USB0_VBUS: U1.AE7(H:USB0_VBUS) ; also sheet 9
SOC_USB1_VBUS [6mil]: U1.AF6(H:USB1_VBUS) ; also sheet 9
SOC_WKUP_SCL: R485.1 U1.AC7(G:WKUP_I2C0_SCL) ; also sheet 3,15,16,17,19
SOC_WKUP_SDA: R486.1 U1.AD6(G:WKUP_I2C0_SDA) ; also sheet 3,15,16,17,19
SOC_WKUP_UART0_CTS_3V3: U1.AC2(G:WKUP_GPIO0_6)
SOC_WKUP_UART0_RTS_3V3: U1.AC1(G:WKUP_GPIO0_7)
SOC_WKUP_UART0_RX_3V3: U1.AB1(G:WKUP_UART0_RXD)
SOC_WKUP_UART0_TX_3V3: U1.AB5(G:WKUP_UART0_TXD)
SPI0_CLK: U1.AH13(H:SPI0_CLK) ; also sheet 19
SPI0_CS0: U1.AG13(H:SPI0_CS0) ; also sheet 19
SPI0_MISO: U1.AD13(H:SPI0_D1) ; also sheet 19
SPI0_MOSI: U1.AE13(H:SPI0_D0) ; also sheet 19
SPI1_CLK: U1.AH12(H:SPI1_CLK) ; also sheet 16,19
SPI1_CS0: U1.AD12(H:SPI1_CS0) ; also sheet 16,19
SPI1_MISO: U1.AF12(H:SPI1_D1) ; also sheet 16,19
SPI1_MOSI: U1.AE12(H:SPI1_D0) ; also sheet 16,19
SPI2_CLK: U1.AE23(F:PRG1_PRU1_GPO17)
SPI2_CS0: U1.AD23(F:PRG1_PRU1_GPO7)
SPI2_D0: U1.AD22(F:PRG1_PRU1_GPO18)
SPI2_D1: U1.AC21(F:PRG1_PRU1_GPO19)
TEMP_DIODE_P: TP9.TP U1.W6(H:TEMP_DIODE_P)
TIMER_IO0: U1.B22(H:TIMER_IO0)
TIMER_IO1: U1.C23(H:TIMER_IO1)
UART2_CTS: U1.Y26(F:PRG0_PRU1_GPO18) ; also sheet 19
UART2_RTS: U1.W26(F:PRG0_PRU1_GPO19) ; also sheet 19
UART2_RXD: U1.Y27(F:PRG0_PRU1_GPO17) ; also sheet 19
UART2_TXD: U1.W28(F:PRG0_PRU1_GPO7) ; also sheet 19
USB0_D_N [6mil]: U1.AE2(H:USB0_DM) ; also sheet 19
USB0_D_P [6mil]: U1.AF1(H:USB0_DP) ; also sheet 19
USB0_DRV_VBUS [6mil]: U1.AD9(H:USB0_DRVVBUS) ; also sheet 19
USB0_ID_SOC [6mil]: U1.AF7(H:USB0_ID) ; also sheet 19
USB1_D_N [6mil]: U1.AD2(H:USB1_DM) ; also sheet 9
USB1_D_P [6mil]: U1.AE1(H:USB1_DP) ; also sheet 9
USB1_DRV_VBUS [6mil]: U1.AC8(H:USB1_DRVVBUS)
USB1_ID [6mil]: U1.AF5(H:USB1_ID) ; also sheet 9
VCC_1V8: R463.2 R464.1 ; also sheet 3,6,7,8,10,13,14,15,18,19
VCC_3V3_IO: R484.1 R485.2 R486.2 R487.1 R488.1 R489.1 R490.1 R491.2 R492.2 R559.1 R592.1 R593.1 ; also sheet 3,5,6,7,8,9,10,11,13,14,15,16,17,19
VCC_3V3_PREREG: R141.2 ; also sheet 3,5
VDDA_SYS_MON: R141.1 R142.2 ; also sheet 2
VSS: C99.1 C100.1 C101.1 C102.1 C103.1 C104.1 C105.1 C106.1 C107.1 C108.1 C109.1 C110.1 C111.1 C112.1 C113.1 C114.1 C115.1 C326.1 C327.1 C328.1 C329.1 C587.1 C588.1 C589.2 C590.2 R102.1 R106.2 R142.1 R557.2 R558.2 R564.2 R565.2 R566.2 R567.2 R594.1 ; also sheet 2,3,4,5,6,7,8,9,10,11,12,13,14,15,16,17,18,19
WKUP_GPIO0_25: U1.T1(A:MCU_OSPI1_CLK)
WKUP_GPIO0_26: U1.R1(A:MCU_OSPI1_LBCLKO)
WKUP_GPIO0_32: U1.N2(A:MCU_OSPI1_CSN0)
WKUP_LFOSC_RTC_XIN: U1.AE4(G:WKUP_LFOSC0_XI) ; also sheet 14
WKUP_OSC_XIN: U1.AD5(G:WKUP_OSC0_XI) ; also sheet 14
WKUP_OSC_XOUT: U1.AE6(G:WKUP_OSC0_XO) ; also sheet 14
Unconnected: U1.AA6(H:RSV2) U1.AC4(G:WKUP_LFOSC0_XO) U1.AC13(B:RSV9) U1.AC23(H:RSV4) U1.AD10(B:RSV8) U1.B1(H:RSV3) U1.B28(H:RSV10) U1.T25(H:GPMC0_WPN)

## Sheet 2 of 19: Power & Decaps
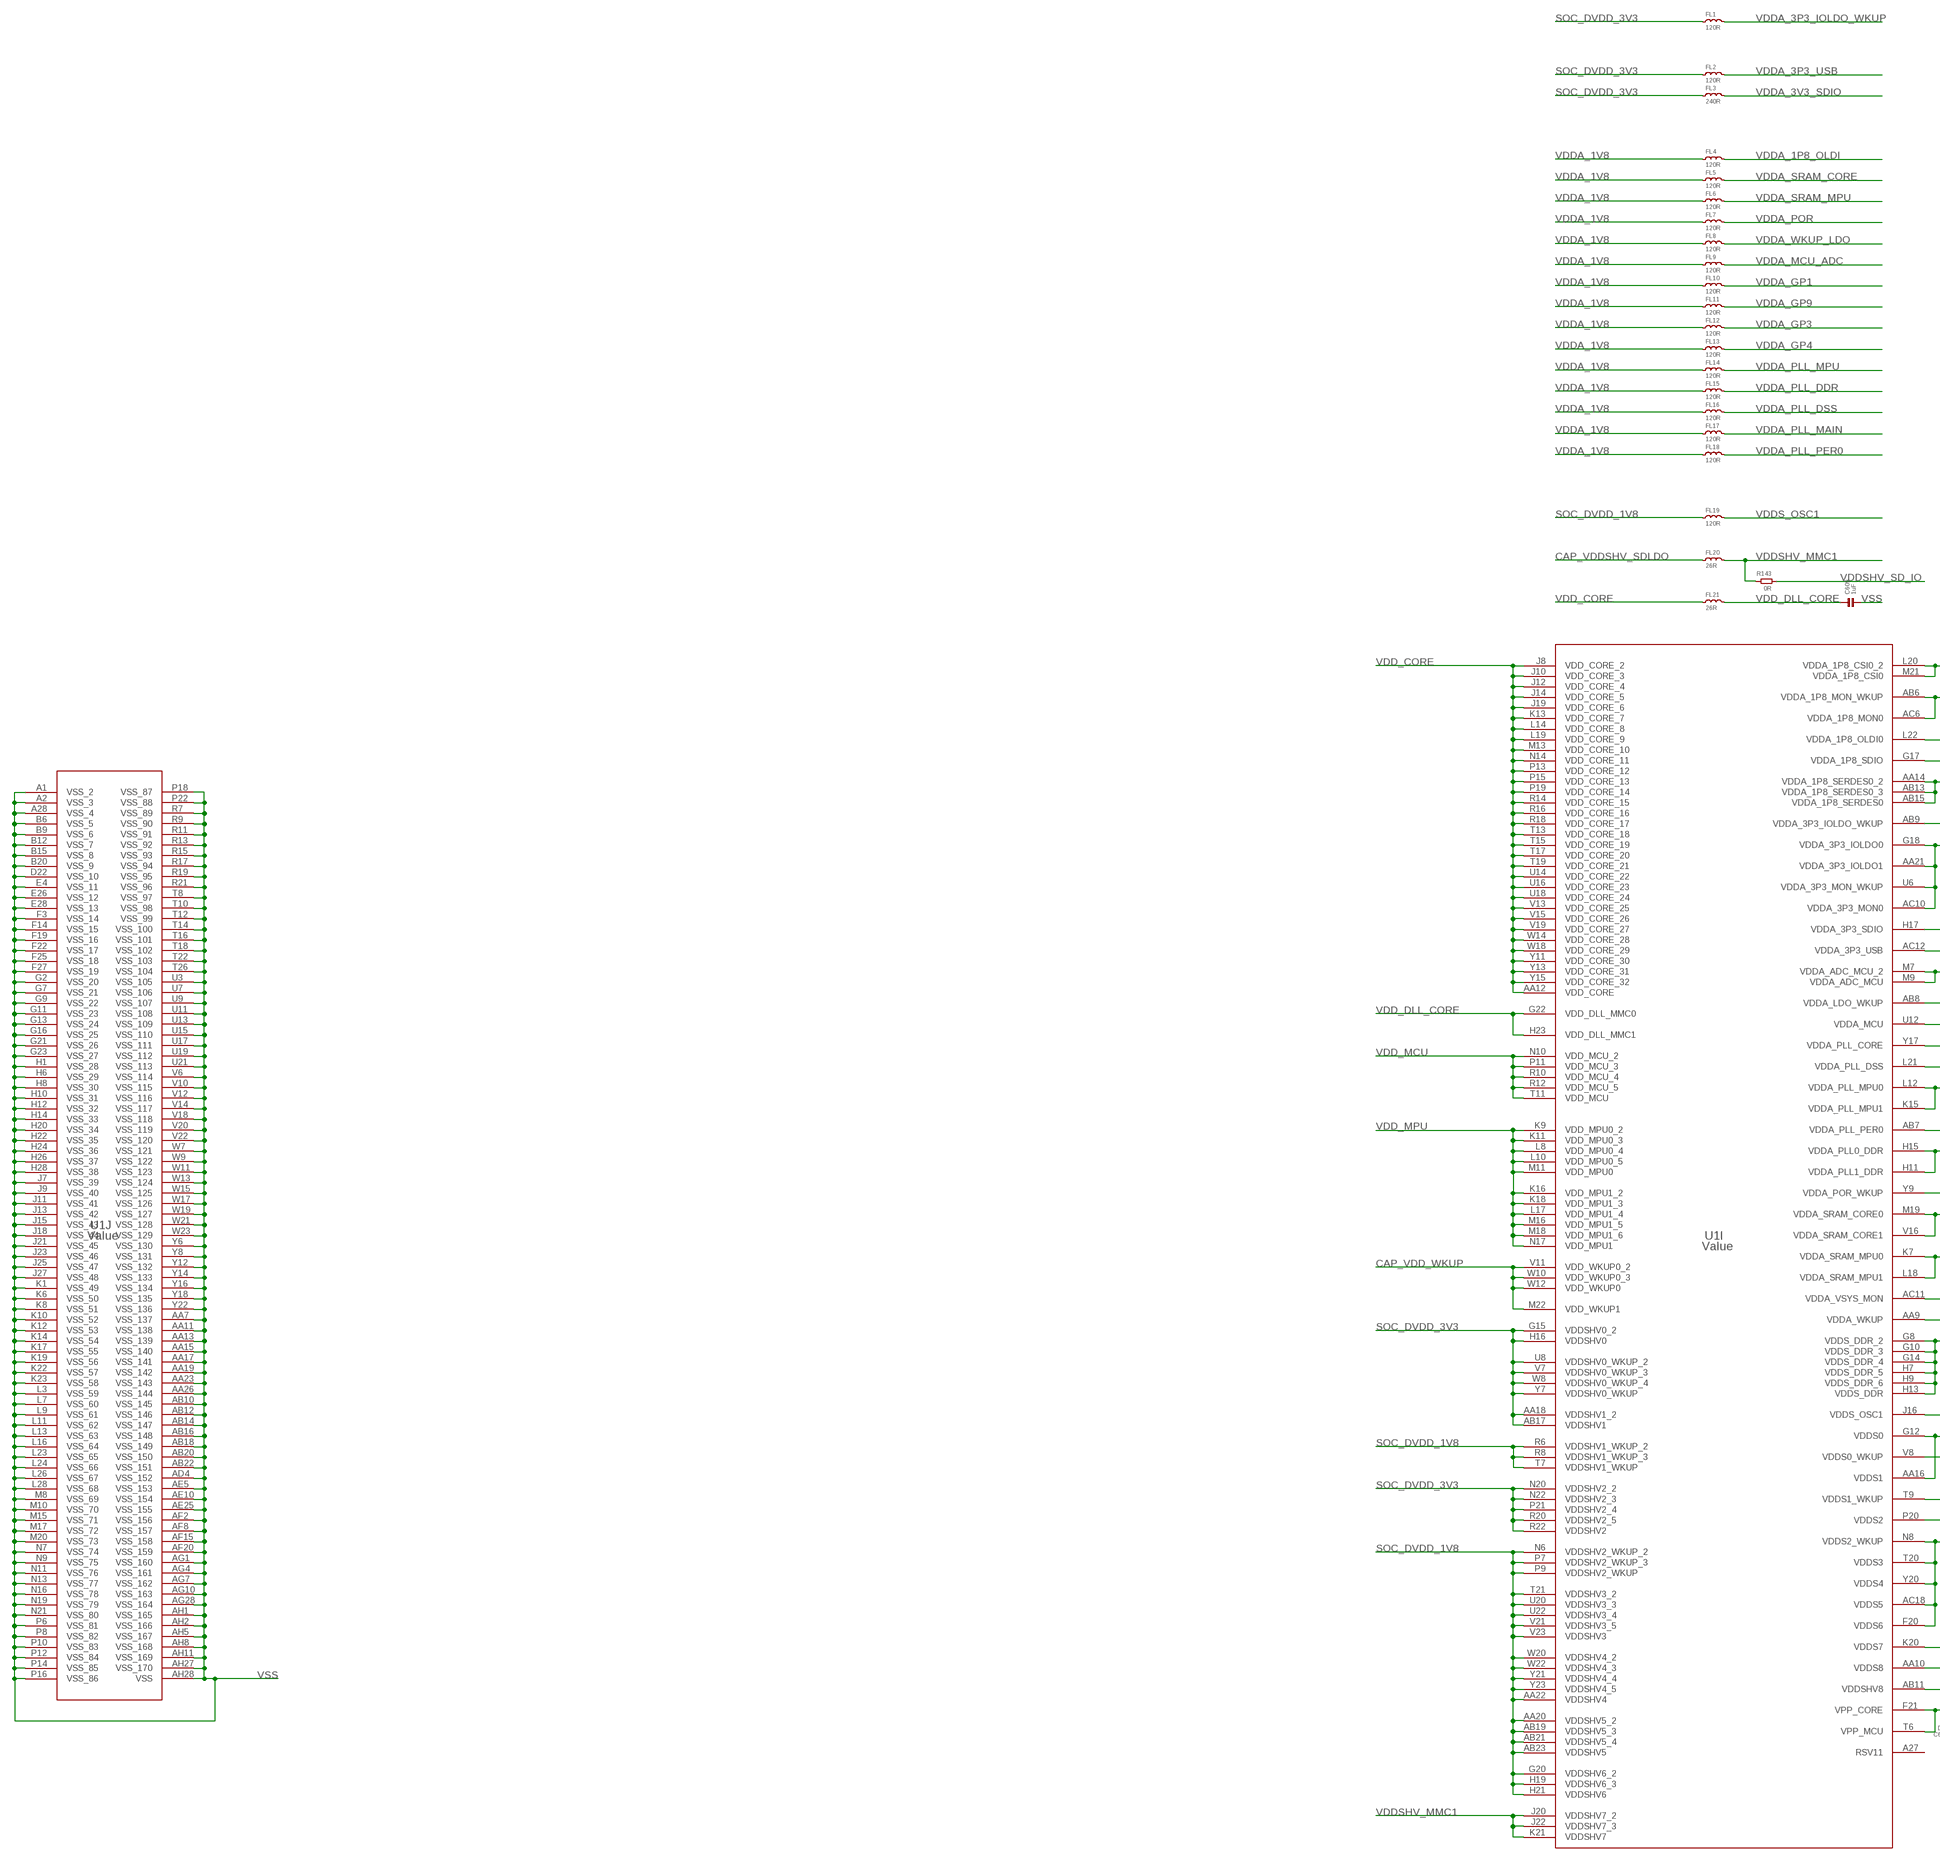
[diagram p2: schematic, sheet 2, part 1 of 2]
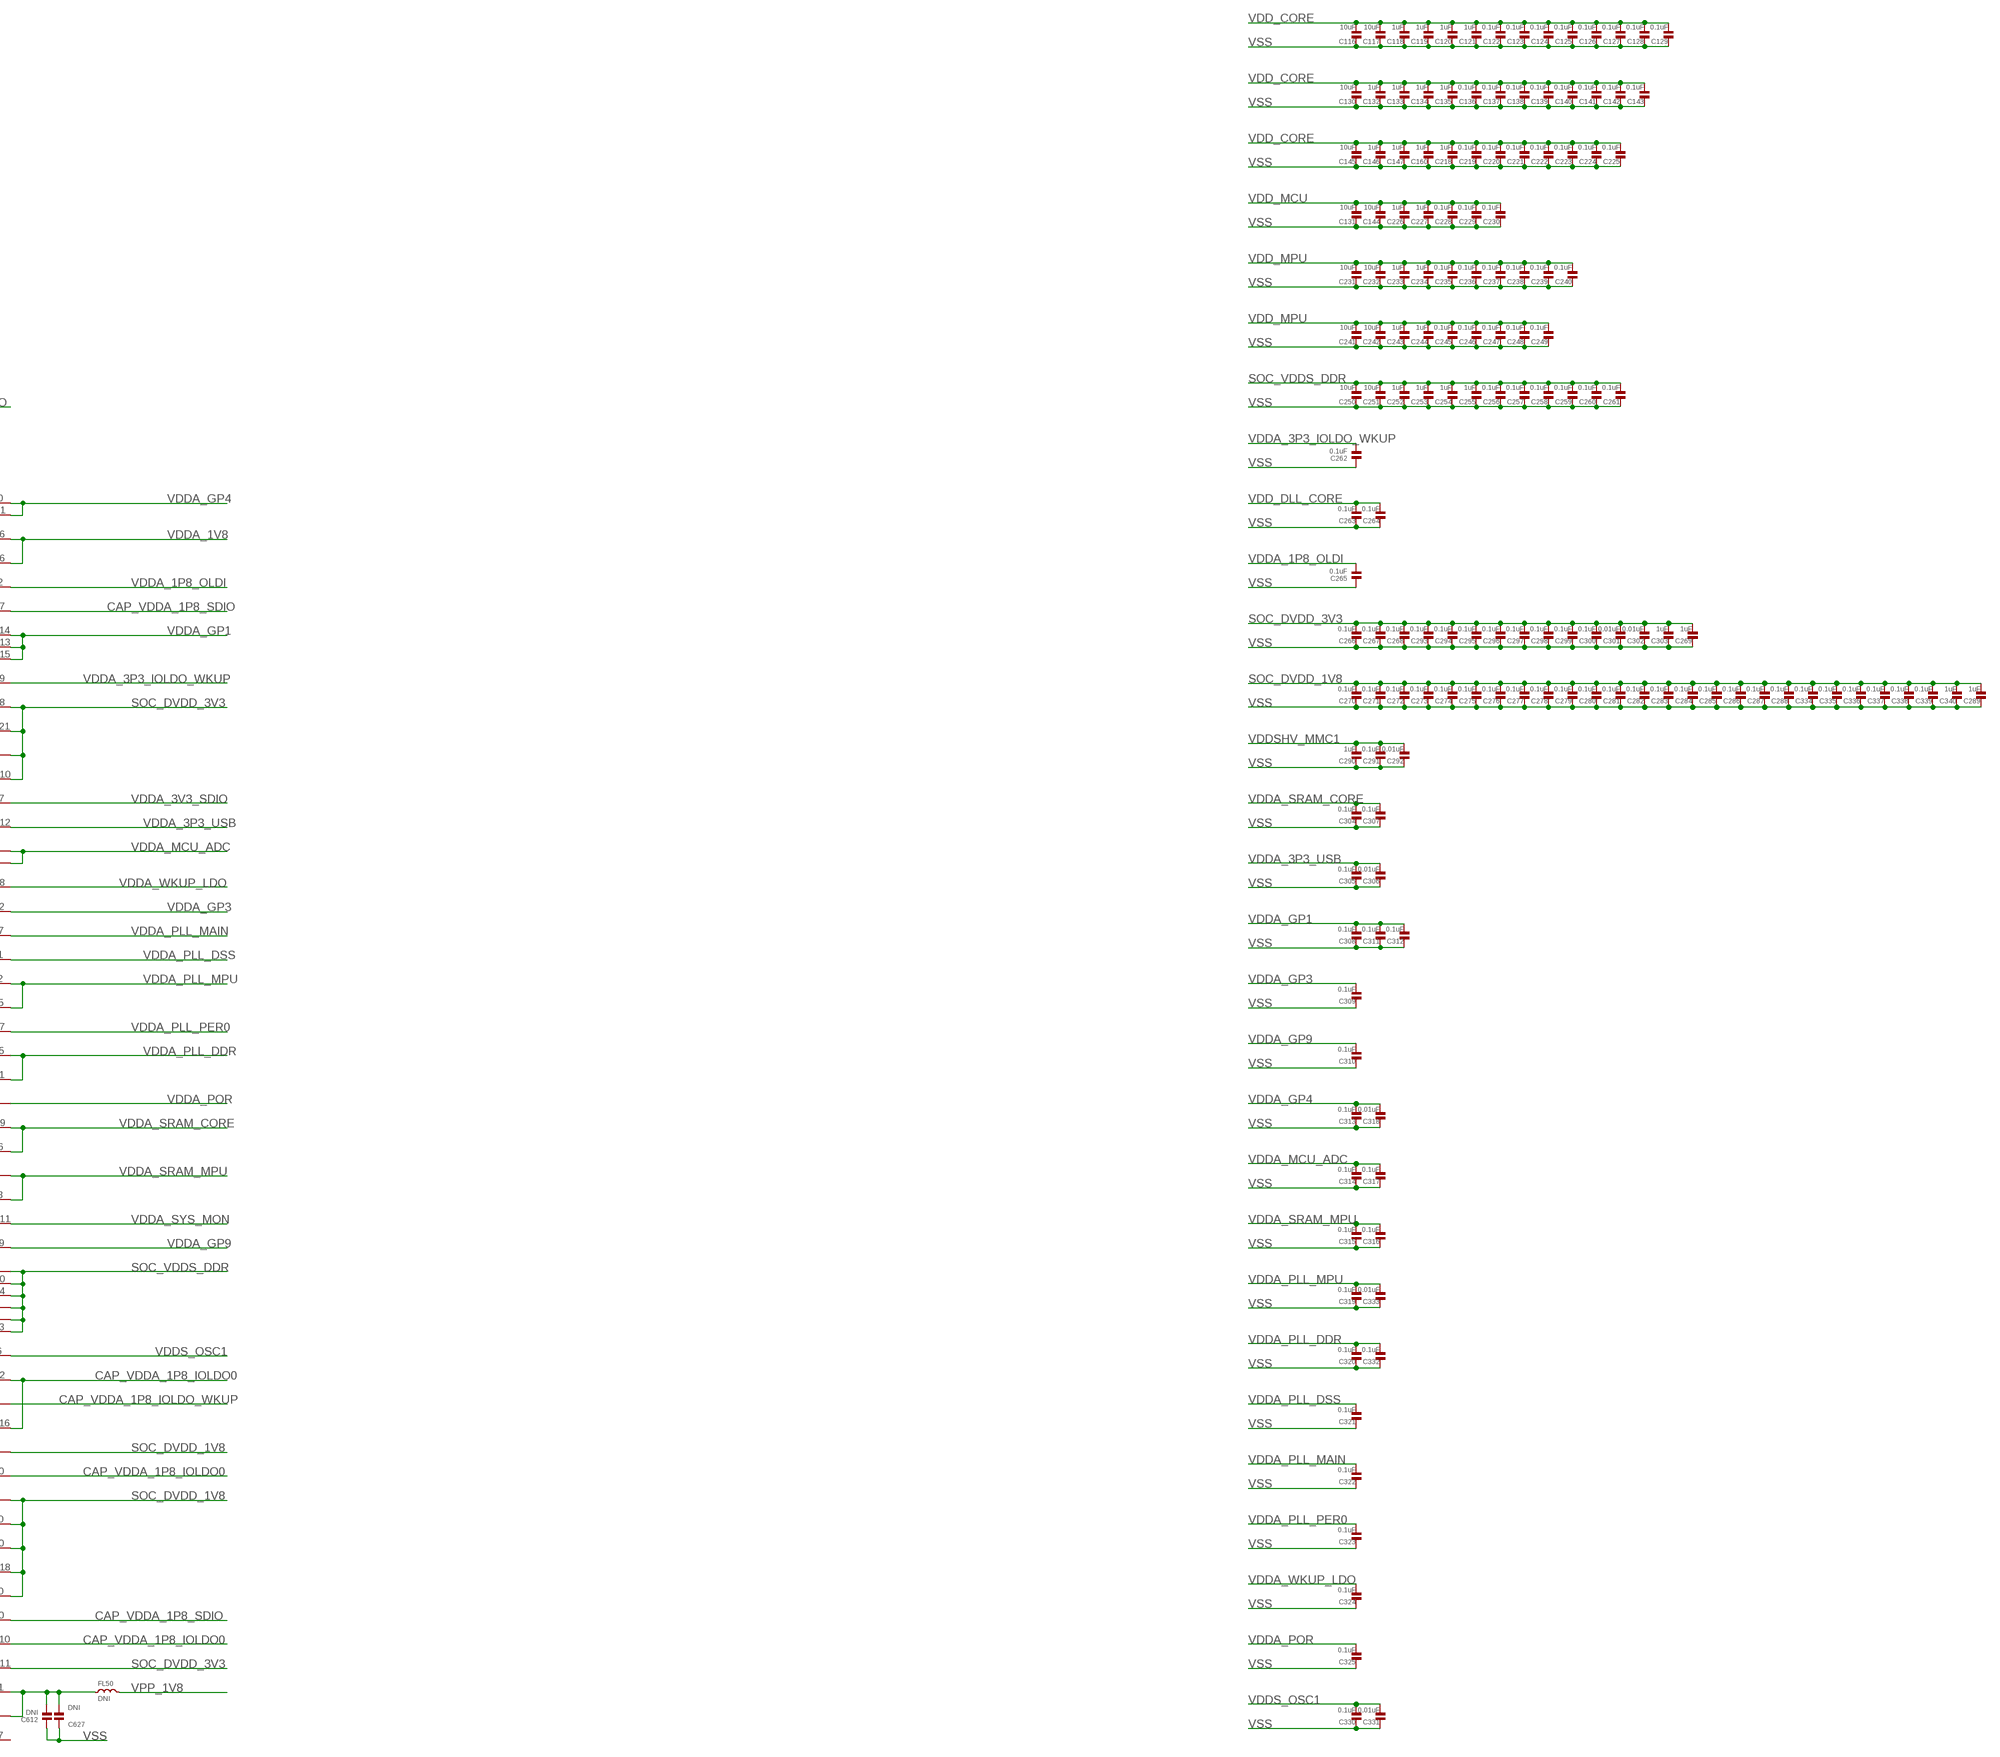
[diagram p3: schematic, sheet 2, part 2 of 2]

### Parts
C116  10uF  CAPACITOR.0201  [0201]
C117  10uF  CAPACITOR.0201  [0201]
C118  1uF  CAPACITOR.0201  [0201]
C119  1uF  CAPACITOR.0201  [0201]
C120  1uF  CAPACITOR.0201  [0201]
C121  1uF  CAPACITOR.0201  [0201]
C122  0.1uF  CAPACITOR.0201  [0201]
C123  0.1uF  CAPACITOR.0201  [0201]
C124  0.1uF  CAPACITOR.0201  [0201]
C125  0.1uF  CAPACITOR.0201  [0201]
C126  0.1uF  CAPACITOR.0201  [0201]
C127  0.1uF  CAPACITOR.0201  [0201]
C128  0.1uF  CAPACITOR.0201  [0201]
C129  0.1uF  CAPACITOR.0201  [0201]
C130  10uF  CAPACITOR.0201  [0201]
C131  10uF  CAPACITOR.0201  [0201]
C132  1uF  CAPACITOR.0201  [0201]
C133  1uF  CAPACITOR.0201  [0201]
C134  1uF  CAPACITOR.0201  [0201]
C135  1uF  CAPACITOR.0201  [0201]
C136  0.1uF  CAPACITOR.0201  [0201]
C137  0.1uF  CAPACITOR.0201  [0201]
C138  0.1uF  CAPACITOR.0201  [0201]
C139  0.1uF  CAPACITOR.0201  [0201]
C140  0.1uF  CAPACITOR.0201  [0201]
C141  0.1uF  CAPACITOR.0201  [0201]
C142  0.1uF  CAPACITOR.0201  [0201]
C143  0.1uF  CAPACITOR.0201  [0201]
C144  10uF  CAPACITOR.0201  [0201]
C145  10uF  CAPACITOR.0201  [0201]
C146  1uF  CAPACITOR.0201  [0201]
C147  1uF  CAPACITOR.0201  [0201]
C160  1uF  CAPACITOR.0201  [0201]
C218  1uF  CAPACITOR.0201  [0201]
C219  0.1uF  CAPACITOR.0201  [0201]
C220  0.1uF  CAPACITOR.0201  [0201]
C221  0.1uF  CAPACITOR.0201  [0201]
C222  0.1uF  CAPACITOR.0201  [0201]
C223  0.1uF  CAPACITOR.0201  [0201]
C224  0.1uF  CAPACITOR.0201  [0201]
C225  0.1uF  CAPACITOR.0201  [0201]
C226  1uF  CAPACITOR.0201  [0201]
C227  1uF  CAPACITOR.0201  [0201]
C228  0.1uF  CAPACITOR.0201  [0201]
C229  0.1uF  CAPACITOR.0201  [0201]
C230  0.1uF  CAPACITOR.0201  [0201]
C231  10uF  CAPACITOR.0201  [0201]
C232  10uF  CAPACITOR.0201  [0201]
C233  1uF  CAPACITOR.0201  [0201]
C234  1uF  CAPACITOR.0201  [0201]
C235  0.1uF  CAPACITOR.0201  [0201]
C236  0.1uF  CAPACITOR.0201  [0201]
C237  0.1uF  CAPACITOR.0201  [0201]
C238  0.1uF  CAPACITOR.0201  [0201]
C239  0.1uF  CAPACITOR.0201  [0201]
C240  0.1uF  CAPACITOR.0201  [0201]
C241  10uF  CAPACITOR.0201  [0201]
C242  10uF  CAPACITOR.0201  [0201]
C243  1uF  CAPACITOR.0201  [0201]
C244  1uF  CAPACITOR.0201  [0201]
C245  0.1uF  CAPACITOR.0201  [0201]
C246  0.1uF  CAPACITOR.0201  [0201]
C247  0.1uF  CAPACITOR.0201  [0201]
C248  0.1uF  CAPACITOR.0201  [0201]
C249  0.1uF  CAPACITOR.0201  [0201]
C250  10uF  CAPACITOR.0201  [0201]
C251  10uF  CAPACITOR.0201  [0201]
C252  1uF  CAPACITOR.0201  [0201]
C253  1uF  CAPACITOR.0201  [0201]
C254  1uF  CAPACITOR.0201  [0201]
C255  1uF  CAPACITOR.0201  [0201]
C256  0.1uF  CAPACITOR.0201  [0201]
C257  0.1uF  CAPACITOR.0201  [0201]
C258  0.1uF  CAPACITOR.0201  [0201]
C259  0.1uF  CAPACITOR.0201  [0201]
C260  0.1uF  CAPACITOR.0201  [0201]
C261  0.1uF  CAPACITOR.0201  [0201]
C262  0.1uF  CAPACITOR.0201  [0201]
C263  0.1uF  CAPACITOR.0201  [0201]
C264  0.1uF  CAPACITOR.0201  [0201]
C265  0.1uF  CAPACITOR.0201  [0201]
C266  0.1uF  CAPACITOR.0201  [0201]
C267  0.1uF  CAPACITOR.0201  [0201]
C268  0.1uF  CAPACITOR.0201  [0201]
C269  1uF  CAPACITOR.0201  [0201]
C270  0.1uF  CAPACITOR.0201  [0201]
C271  0.1uF  CAPACITOR.0201  [0201]
C272  0.1uF  CAPACITOR.0201  [0201]
C273  0.1uF  CAPACITOR.0201  [0201]
C274  0.1uF  CAPACITOR.0201  [0201]
C275  0.1uF  CAPACITOR.0201  [0201]
C276  0.1uF  CAPACITOR.0201  [0201]
C277  0.1uF  CAPACITOR.0201  [0201]
C278  0.1uF  CAPACITOR.0201  [0201]
C279  0.1uF  CAPACITOR.0201  [0201]
C280  0.1uF  CAPACITOR.0201  [0201]
C281  0.1uF  CAPACITOR.0201  [0201]
C282  0.1uF  CAPACITOR.0201  [0201]
C283  0.1uF  CAPACITOR.0201  [0201]
C284  0.1uF  CAPACITOR.0201  [0201]
C285  0.1uF  CAPACITOR.0201  [0201]
C286  0.1uF  CAPACITOR.0201  [0201]
C287  0.1uF  CAPACITOR.0201  [0201]
C288  0.1uF  CAPACITOR.0201  [0201]
C289  1uF  CAPACITOR.0201  [0201]
C290  1uF  CAPACITOR.0201  [0201]
C291  0.1uF  CAPACITOR.0201  [0201]
C292  0.01uF  CAPACITOR.0201  [0201]
C293  0.1uF  CAPACITOR.0201  [0201]
C294  0.1uF  CAPACITOR.0201  [0201]
C295  0.1uF  CAPACITOR.0201  [0201]
C296  0.1uF  CAPACITOR.0201  [0201]
C297  0.1uF  CAPACITOR.0201  [0201]
C298  0.1uF  CAPACITOR.0201  [0201]
C299  0.1uF  CAPACITOR.0201  [0201]
C300  0.1uF  CAPACITOR.0201  [0201]
C301  0.01uF  CAPACITOR.0201  [0201]
C302  0.01uF  CAPACITOR.0201  [0201]
C303  1uF  CAPACITOR.0201  [0201]
C304  0.1uF  CAPACITOR.0201  [0201]
C305  0.1uF  CAPACITOR.0201  [0201]
C306  0.01uF  CAPACITOR.0201  [0201]
C307  0.1uF  CAPACITOR.0201  [0201]
C308  0.1uF  CAPACITOR.0201  [0201]
C309  0.1uF  CAPACITOR.0201  [0201]
C310  0.1uF  CAPACITOR.0201  [0201]
C311  0.1uF  CAPACITOR.0201  [0201]
C312  0.1uF  CAPACITOR.0201  [0201]
C313  0.1uF  CAPACITOR.0201  [0201]
C314  0.1uF  CAPACITOR.0201  [0201]
C315  0.1uF  CAPACITOR.0201  [0201]
C316  0.1uF  CAPACITOR.0201  [0201]
C317  0.1uF  CAPACITOR.0201  [0201]
C318  0.01uF  CAPACITOR.0201  [0201]
C319  0.1uF  CAPACITOR.0201  [0201]
C320  0.1uF  CAPACITOR.0201  [0201]
C321  0.1uF  CAPACITOR.0201  [0201]
C322  0.1uF  CAPACITOR.0201  [0201]
C323  0.1uF  CAPACITOR.0201  [0201]
C324  0.1uF  CAPACITOR.0201  [0201]
C325  0.1uF  CAPACITOR.0201  [0201]
C330  0.1uF  CAPACITOR.0201  [0201]
C331  0.01uF  CAPACITOR.0201  [0201]
C332  0.1uF  CAPACITOR.0201  [0201]
C333  0.01uF  CAPACITOR.0201  [0201]
C334  0.1uF  CAPACITOR.0201  [0201]
C335  0.1uF  CAPACITOR.0201  [0201]
C336  0.1uF  CAPACITOR.0201  [0201]
C337  0.1uF  CAPACITOR.0201  [0201]
C338  0.1uF  CAPACITOR.0201  [0201]
C339  0.1uF  CAPACITOR.0201  [0201]
C340  1uF  CAPACITOR.0201  [0201]
C609  1uF  CAPACITOR.0402  [0402]
C612  DNI  CAPACITOR.0201  [0201]
C627  DNI  CAPACITOR.0201  [0201]
FL1  120R  RF-INDUCTOR.0402  [0402]
FL2  120R  RF-INDUCTOR.0402  [0402]
FL3  240R  RF-INDUCTOR.0402  [0402]
FL4  120R  RF-INDUCTOR.0402  [0402]
FL5  120R  RF-INDUCTOR.0402  [0402]
FL6  120R  RF-INDUCTOR.0402  [0402]
FL7  120R  RF-INDUCTOR.0402  [0402]
FL8  120R  RF-INDUCTOR.0402  [0402]
FL9  120R  RF-INDUCTOR.0402  [0402]
FL10  120R  RF-INDUCTOR.0402  [0402]
FL11  120R  RF-INDUCTOR.0402  [0402]
FL12  120R  RF-INDUCTOR.0402  [0402]
FL13  120R  RF-INDUCTOR.0402  [0402]
FL14  120R  RF-INDUCTOR.0402  [0402]
FL15  120R  RF-INDUCTOR.0402  [0402]
FL16  120R  RF-INDUCTOR.0402  [0402]
FL17  120R  RF-INDUCTOR.0402  [0402]
FL18  120R  RF-INDUCTOR.0402  [0402]
FL19  120R  RF-INDUCTOR.0402  [0402]
FL20  26R  RF-INDUCTOR.0402  [0402]
FL21  26R  RF-INDUCTOR.0402  [0402]
FL50  DNI  RF-INDUCTOR.0402  [0402]
R143  0R  RESISTOR.0402  [0402]

### Nets
CAP_VDD_WKUP: U1.M22(I:VDD_WKUP1) U1.V11(I:VDD_WKUP0_2) U1.W10(I:VDD_WKUP0_3) U1.W12(I:VDD_WKUP0) ; also sheet 1
CAP_VDDA_1P8_IOLDO0: U1.AA10(I:VDDS8) U1.AA16(I:VDDS1) U1.G12(I:VDDS0) U1.P20(I:VDDS2) ; also sheet 1
CAP_VDDA_1P8_IOLDO_WKUP: U1.V8(I:VDDS0_WKUP) ; also sheet 1
CAP_VDDA_1P8_SDIO: U1.G17(I:VDDA_1P8_SDIO) U1.K20(I:VDDS7) ; also sheet 1
CAP_VDDSHV_SDLDO: FL20.1 ; also sheet 1
SOC_DVDD_1V8: C270.2 C271.2 C272.2 C273.2 C274.2 C275.2 C276.2 C277.2 C278.2 C279.2 C280.2 C281.2 C282.2 C283.2 C284.2 C285.2 C286.2 C287.2 C288.2 C289.2 C334.2 C335.2 C336.2 C337.2 C338.2 C339.2 C340.2 FL19.1 U1.AA20(I:VDDSHV5_2) U1.AA22(I:VDDSHV4) U1.AB19(I:VDDSHV5_3) U1.AB21(I:VDDSHV5_4) U1.AB23(I:VDDSHV5) U1.AC18(I:VDDS5) U1.F20(I:VDDS6) U1.G20(I:VDDSHV6_2) U1.H19(I:VDDSHV6_3) U1.H21(I:VDDSHV6) U1.N6(I:VDDSHV2_WKUP_2) U1.N8(I:VDDS2_WKUP) U1.P7(I:VDDSHV2_WKUP_3) U1.P9(I:VDDSHV2_WKUP) U1.R6(I:VDDSHV1_WKUP_2) U1.R8(I:VDDSHV1_WKUP_3) U1.T7(I:VDDSHV1_WKUP) U1.T9(I:VDDS1_WKUP) U1.T20(I:VDDS3) U1.T21(I:VDDSHV3_2) U1.U20(I:VDDSHV3_3) U1.U22(I:VDDSHV3_4) U1.V21(I:VDDSHV3_5) U1.V23(I:VDDSHV3) U1.W20(I:VDDSHV4_2) U1.W22(I:VDDSHV4_3) U1.Y20(I:VDDS4) U1.Y21(I:VDDSHV4_4) U1.Y23(I:VDDSHV4_5) ; also sheet 10
SOC_DVDD_3V3: C266.2 C267.2 C268.2 C269.2 C293.2 C294.2 C295.2 C296.2 C297.2 C298.2 C299.2 C300.2 C301.2 C302.2 C303.2 FL1.1 FL2.1 FL3.1 U1.AA18(I:VDDSHV1_2) U1.AA21(I:VDDA_3P3_IOLDO1) U1.AB11(I:VDDSHV8) U1.AB17(I:VDDSHV1) U1.AC10(I:VDDA_3P3_MON0) U1.G15(I:VDDSHV0_2) U1.G18(I:VDDA_3P3_IOLDO0) U1.H16(I:VDDSHV0) U1.N20(I:VDDSHV2_2) U1.N22(I:VDDSHV2_3) U1.P21(I:VDDSHV2_4) U1.R20(I:VDDSHV2_5) U1.R22(I:VDDSHV2) U1.U6(I:VDDA_3P3_MON_WKUP) U1.U8(I:VDDSHV0_WKUP_2) U1.V7(I:VDDSHV0_WKUP_3) U1.W8(I:VDDSHV0_WKUP_4) U1.Y7(I:VDDSHV0_WKUP) ; also sheet 1,10
SOC_VDDS_DDR: C250.2 C251.2 C252.2 C253.2 C254.2 C255.2 C256.2 C257.2 C258.2 C259.2 C260.2 C261.2 U1.G8(I:VDDS_DDR_2) U1.G10(I:VDDS_DDR_3) U1.G14(I:VDDS_DDR_4) U1.H7(I:VDDS_DDR_5) U1.H9(I:VDDS_DDR_6) U1.H13(I:VDDS_DDR) ; also sheet 10
VDD_CORE: C116.2 C117.2 C118.2 C119.2 C120.2 C121.2 C122.2 C123.2 C124.2 C125.2 C126.2 C127.2 C128.2 C129.2 C130.2 C132.2 C133.2 C134.2 C135.2 C136.2 C137.2 C138.2 C139.2 C140.2 C141.2 C142.2 C143.2 C145.2 C146.2 C147.2 C160.2 C218.2 C219.2 C220.2 C221.2 C222.2 C223.2 C224.2 C225.2 FL21.1 U1.AA12(I:VDD_CORE) U1.J8(I:VDD_CORE_2) U1.J10(I:VDD_CORE_3) U1.J12(I:VDD_CORE_4) U1.J14(I:VDD_CORE_5) U1.J19(I:VDD_CORE_6) U1.K13(I:VDD_CORE_7) U1.L14(I:VDD_CORE_8) U1.L19(I:VDD_CORE_9) U1.M13(I:VDD_CORE_10) U1.N14(I:VDD_CORE_11) U1.P13(I:VDD_CORE_12) U1.P15(I:VDD_CORE_13) U1.P19(I:VDD_CORE_14) U1.R14(I:VDD_CORE_15) U1.R16(I:VDD_CORE_16) U1.R18(I:VDD_CORE_17) U1.T13(I:VDD_CORE_18) U1.T15(I:VDD_CORE_19) U1.T17(I:VDD_CORE_20) U1.T19(I:VDD_CORE_21) U1.U14(I:VDD_CORE_22) U1.U16(I:VDD_CORE_23) U1.U18(I:VDD_CORE_24) U1.V13(I:VDD_CORE_25) U1.V15(I:VDD_CORE_26) U1.V19(I:VDD_CORE_27) U1.W14(I:VDD_CORE_28) U1.W18(I:VDD_CORE_29) U1.Y11(I:VDD_CORE_30) U1.Y13(I:VDD_CORE_31) U1.Y15(I:VDD_CORE_32) ; also sheet 3,10
VDD_DLL_CORE: C263.2 C264.2 C609.1 FL21.2 U1.G22(I:VDD_DLL_MMC0) U1.H23(I:VDD_DLL_MMC1)
VDD_MCU: C131.2 C144.2 C226.2 C227.2 C228.2 C229.2 C230.2 U1.N10(I:VDD_MCU_2) U1.P11(I:VDD_MCU_3) U1.R10(I:VDD_MCU_4) U1.R12(I:VDD_MCU_5) U1.T11(I:VDD_MCU) ; also sheet 10
VDD_MPU: C231.2 C232.2 C233.2 C234.2 C235.2 C236.2 C237.2 C238.2 C239.2 C240.2 C241.2 C242.2 C243.2 C244.2 C245.2 C246.2 C247.2 C248.2 C249.2 U1.K9(I:VDD_MPU0_2) U1.K11(I:VDD_MPU0_3) U1.K16(I:VDD_MPU1_2) U1.K18(I:VDD_MPU1_3) U1.L8(I:VDD_MPU0_4) U1.L10(I:VDD_MPU0_5) U1.L17(I:VDD_MPU1_4) U1.M11(I:VDD_MPU0) U1.M16(I:VDD_MPU1_5) U1.M18(I:VDD_MPU1_6) U1.N17(I:VDD_MPU1) ; also sheet 3,5,10
VDDA_1P8_OLDI: C265.2 FL4.2 U1.L22(I:VDDA_1P8_OLDI0)
VDDA_1V8: FL4.1 FL5.1 FL6.1 FL7.1 FL8.1 FL9.1 FL10.1 FL11.1 FL12.1 FL13.1 FL14.1 FL15.1 FL16.1 FL17.1 FL18.1 U1.AB6(I:VDDA_1P8_MON_WKUP) U1.AC6(I:VDDA_1P8_MON0) ; also sheet 10
VDDA_3P3_IOLDO_WKUP: C262.2 FL1.2 U1.AB9(I:VDDA_3P3_IOLDO_WKUP)
VDDA_3P3_USB: C305.2 C306.2 FL2.2 U1.AC12(I:VDDA_3P3_USB)
VDDA_3V3_SDIO: FL3.2 U1.H17(I:VDDA_3P3_SDIO)
VDDA_GP1: C308.2 C311.2 C312.2 FL10.2 U1.AA14(I:VDDA_1P8_SERDES0_2) U1.AB13(I:VDDA_1P8_SERDES0_3) U1.AB15(I:VDDA_1P8_SERDES0)
VDDA_GP3: C309.2 FL12.2 U1.U12(I:VDDA_MCU)
VDDA_GP4: C313.2 C318.2 FL13.2 U1.L20(I:VDDA_1P8_CSI0_2) U1.M21(I:VDDA_1P8_CSI0)
VDDA_GP9: C310.2 FL11.2 U1.AA9(I:VDDA_WKUP)
VDDA_MCU_ADC: C314.2 C317.2 FL9.2 U1.M7(I:VDDA_ADC_MCU_2) U1.M9(I:VDDA_ADC_MCU)
VDDA_PLL_DDR: C320.2 C332.2 FL15.2 U1.H11(I:VDDA_PLL1_DDR) U1.H15(I:VDDA_PLL0_DDR)
VDDA_PLL_DSS: C321.2 FL16.2 U1.L21(I:VDDA_PLL_DSS)
VDDA_PLL_MAIN: C322.2 FL17.2 U1.Y17(I:VDDA_PLL_CORE)
VDDA_PLL_MPU: C319.2 C333.2 FL14.2 U1.K15(I:VDDA_PLL_MPU1) U1.L12(I:VDDA_PLL_MPU0)
VDDA_PLL_PER0: C323.2 FL18.2 U1.AB7(I:VDDA_PLL_PER0)
VDDA_POR: C325.2 FL7.2 U1.Y9(I:VDDA_POR_WKUP)
VDDA_SRAM_CORE: C304.2 C307.2 FL5.2 U1.M19(I:VDDA_SRAM_CORE0) U1.V16(I:VDDA_SRAM_CORE1)
VDDA_SRAM_MPU: C315.2 C316.2 FL6.2 U1.K7(I:VDDA_SRAM_MPU0) U1.L18(I:VDDA_SRAM_MPU1)
VDDA_SYS_MON: U1.AC11(I:VDDA_VSYS_MON) ; also sheet 1
VDDA_WKUP_LDO: C324.2 FL8.2 U1.AB8(I:VDDA_LDO_WKUP)
VDDS_OSC1: C330.2 C331.2 FL19.2 U1.J16(I:VDDS_OSC1)
VDDSHV_MMC1: C290.2 C291.2 C292.2 FL20.2 R143.1 U1.J20(I:VDDSHV7_2) U1.J22(I:VDDSHV7_3) U1.K21(I:VDDSHV7)
VDDSHV_SD_IO: R143.2 ; also sheet 13
VPP_1V8: FL50.2 ; also sheet 3
VPP_CORE_MCU: C612.2 C627.2 FL50.1 U1.F21(I:VPP_CORE) U1.T6(I:VPP_MCU)
VSS: C116.1 C117.1 C118.1 C119.1 C120.1 C121.1 C122.1 C123.1 C124.1 C125.1 C126.1 C127.1 C128.1 C129.1 C130.1 C131.1 C132.1 C133.1 C134.1 C135.1 C136.1 C137.1 C138.1 C139.1 C140.1 C141.1 C142.1 C143.1 C144.1 C145.1 C146.1 C147.1 C160.1 C218.1 C219.1 C220.1 C221.1 C222.1 C223.1 C224.1 C225.1 C226.1 C227.1 C228.1 C229.1 C230.1 C231.1 C232.1 C233.1 C234.1 C235.1 C236.1 C237.1 C238.1 C239.1 C240.1 C241.1 C242.1 C243.1 C244.1 C245.1 C246.1 C247.1 C248.1 C249.1 C250.1 C251.1 C252.1 C253.1 C254.1 C255.1 C256.1 C257.1 C258.1 C259.1 C260.1 C261.1 C262.1 C263.1 C264.1 C265.1 C266.1 C267.1 C268.1 C269.1 C270.1 C271.1 C272.1 C273.1 C274.1 C275.1 C276.1 C277.1 C278.1 C279.1 C280.1 C281.1 C282.1 C283.1 C284.1 C285.1 C286.1 C287.1 C288.1 C289.1 C290.1 C291.1 C292.1 C293.1 C294.1 C295.1 C296.1 C297.1 C298.1 C299.1 C300.1 C301.1 C302.1 C303.1 C304.1 C305.1 C306.1 C307.1 C308.1 C309.1 C310.1 C311.1 C312.1 C313.1 C314.1 C315.1 C316.1 C317.1 C318.1 C319.1 C320.1 C321.1 C322.1 C323.1 C324.1 C325.1 C330.1 C331.1 C332.1 C333.1 C334.1 C335.1 C336.1 C337.1 C338.1 C339.1 C340.1 C609.2 C612.1 C627.1 U1.A1(J:VSS_2) U1.A2(J:VSS_3) U1.A28(J:VSS_4) U1.AA7(J:VSS_137) U1.AA11(J:VSS_138) U1.AA13(J:VSS_139) U1.AA15(J:VSS_140) U1.AA17(J:VSS_141) U1.AA19(J:VSS_142) U1.AA23(J:VSS_143) U1.AA26(J:VSS_144) U1.AB10(J:VSS_145) U1.AB12(J:VSS_146) U1.AB14(J:VSS_147) U1.AB16(J:VSS_148) U1.AB18(J:VSS_149) U1.AB20(J:VSS_150) U1.AB22(J:VSS_151) U1.AD4(J:VSS_152) U1.AE5(J:VSS_153) U1.AE10(J:VSS_154) U1.AE25(J:VSS_155) U1.AF2(J:VSS_156) U1.AF8(J:VSS_157) U1.AF15(J:VSS_158) U1.AF20(J:VSS_159) U1.AG1(J:VSS_160) U1.AG4(J:VSS_161) U1.AG7(J:VSS_162) U1.AG10(J:VSS_163) U1.AG28(J:VSS_164) U1.AH1(J:VSS_165) U1.AH2(J:VSS_166) U1.AH5(J:VSS_167) U1.AH8(J:VSS_168) U1.AH11(J:VSS_169) U1.AH27(J:VSS_170) U1.AH28(J:VSS) U1.B6(J:VSS_5) U1.B9(J:VSS_6) U1.B12(J:VSS_7) U1.B15(J:VSS_8) U1.B20(J:VSS_9) U1.D22(J:VSS_10) U1.E4(J:VSS_11) U1.E26(J:VSS_12) U1.E28(J:VSS_13) U1.F3(J:VSS_14) U1.F14(J:VSS_15) U1.F19(J:VSS_16) U1.F22(J:VSS_17) U1.F25(J:VSS_18) U1.F27(J:VSS_19) U1.G2(J:VSS_20) U1.G7(J:VSS_21) U1.G9(J:VSS_22) U1.G11(J:VSS_23) U1.G13(J:VSS_24) U1.G16(J:VSS_25) U1.G21(J:VSS_26) U1.G23(J:VSS_27) U1.H1(J:VSS_28) U1.H6(J:VSS_29) U1.H8(J:VSS_30) U1.H10(J:VSS_31) U1.H12(J:VSS_32) U1.H14(J:VSS_33) U1.H20(J:VSS_34) U1.H22(J:VSS_35) U1.H24(J:VSS_36) U1.H26(J:VSS_37) U1.H28(J:VSS_38) U1.J7(J:VSS_39) U1.J9(J:VSS_40) U1.J11(J:VSS_41) U1.J13(J:VSS_42) U1.J15(J:VSS_43) U1.J18(J:VSS_44) U1.J21(J:VSS_45) U1.J23(J:VSS_46) U1.J25(J:VSS_47) U1.J27(J:VSS_48) U1.K1(J:VSS_49) U1.K6(J:VSS_50) U1.K8(J:VSS_51) U1.K10(J:VSS_52) U1.K12(J:VSS_53) U1.K14(J:VSS_54) U1.K17(J:VSS_55) U1.K19(J:VSS_56) U1.K22(J:VSS_57) U1.K23(J:VSS_58) U1.L3(J:VSS_59) U1.L7(J:VSS_60) U1.L9(J:VSS_61) U1.L11(J:VSS_62) U1.L13(J:VSS_63) U1.L16(J:VSS_64) U1.L23(J:VSS_65) U1.L24(J:VSS_66) U1.L26(J:VSS_67) U1.L28(J:VSS_68) U1.M8(J:VSS_69) U1.M10(J:VSS_70) U1.M15(J:VSS_71) U1.M17(J:VSS_72) U1.M20(J:VSS_73) U1.N7(J:VSS_74) U1.N9(J:VSS_75) U1.N11(J:VSS_76) U1.N13(J:VSS_77) U1.N16(J:VSS_78) U1.N19(J:VSS_79) U1.N21(J:VSS_80) U1.P6(J:VSS_81) U1.P8(J:VSS_82) U1.P10(J:VSS_83) U1.P12(J:VSS_84) U1.P14(J:VSS_85) U1.P16(J:VSS_86) U1.P18(J:VSS_87) U1.P22(J:VSS_88) U1.R7(J:VSS_89) U1.R9(J:VSS_90) U1.R11(J:VSS_91) U1.R13(J:VSS_92) U1.R15(J:VSS_93) U1.R17(J:VSS_94) U1.R19(J:VSS_95) U1.R21(J:VSS_96) U1.T8(J:VSS_97) U1.T10(J:VSS_98) U1.T12(J:VSS_99) U1.T14(J:VSS_100) U1.T16(J:VSS_101) U1.T18(J:VSS_102) U1.T22(J:VSS_103) U1.T26(J:VSS_104) U1.U3(J:VSS_105) U1.U7(J:VSS_106) U1.U9(J:VSS_107) U1.U11(J:VSS_108) U1.U13(J:VSS_109) U1.U15(J:VSS_110) U1.U17(J:VSS_111) U1.U19(J:VSS_112) U1.U21(J:VSS_113) U1.V6(J:VSS_114) U1.V10(J:VSS_115) U1.V12(J:VSS_116) U1.V14(J:VSS_117) U1.V18(J:VSS_118) U1.V20(J:VSS_119) U1.V22(J:VSS_120) U1.W7(J:VSS_121) U1.W9(J:VSS_122) U1.W11(J:VSS_123) U1.W13(J:VSS_124) U1.W15(J:VSS_125) U1.W17(J:VSS_126) U1.W19(J:VSS_127) U1.W21(J:VSS_128) U1.W23(J:VSS_129) U1.Y6(J:VSS_130) U1.Y8(J:VSS_131) U1.Y12(J:VSS_132) U1.Y14(J:VSS_133) U1.Y16(J:VSS_134) U1.Y18(J:VSS_135) U1.Y22(J:VSS_136) ; also sheet 1,3,4,5,6,7,8,9,10,11,12,13,14,15,16,17,18,19